# Altium schematic sheet DACֹֹ_Sources.SchDoc (part 1 of 2)
size A0; SheetNumber: 1; SheetTotal: 3; SPICEModelCacheJFWWXDGG: <root> / <DocumentId>JFWWXDGG</DocumentId> / </root>
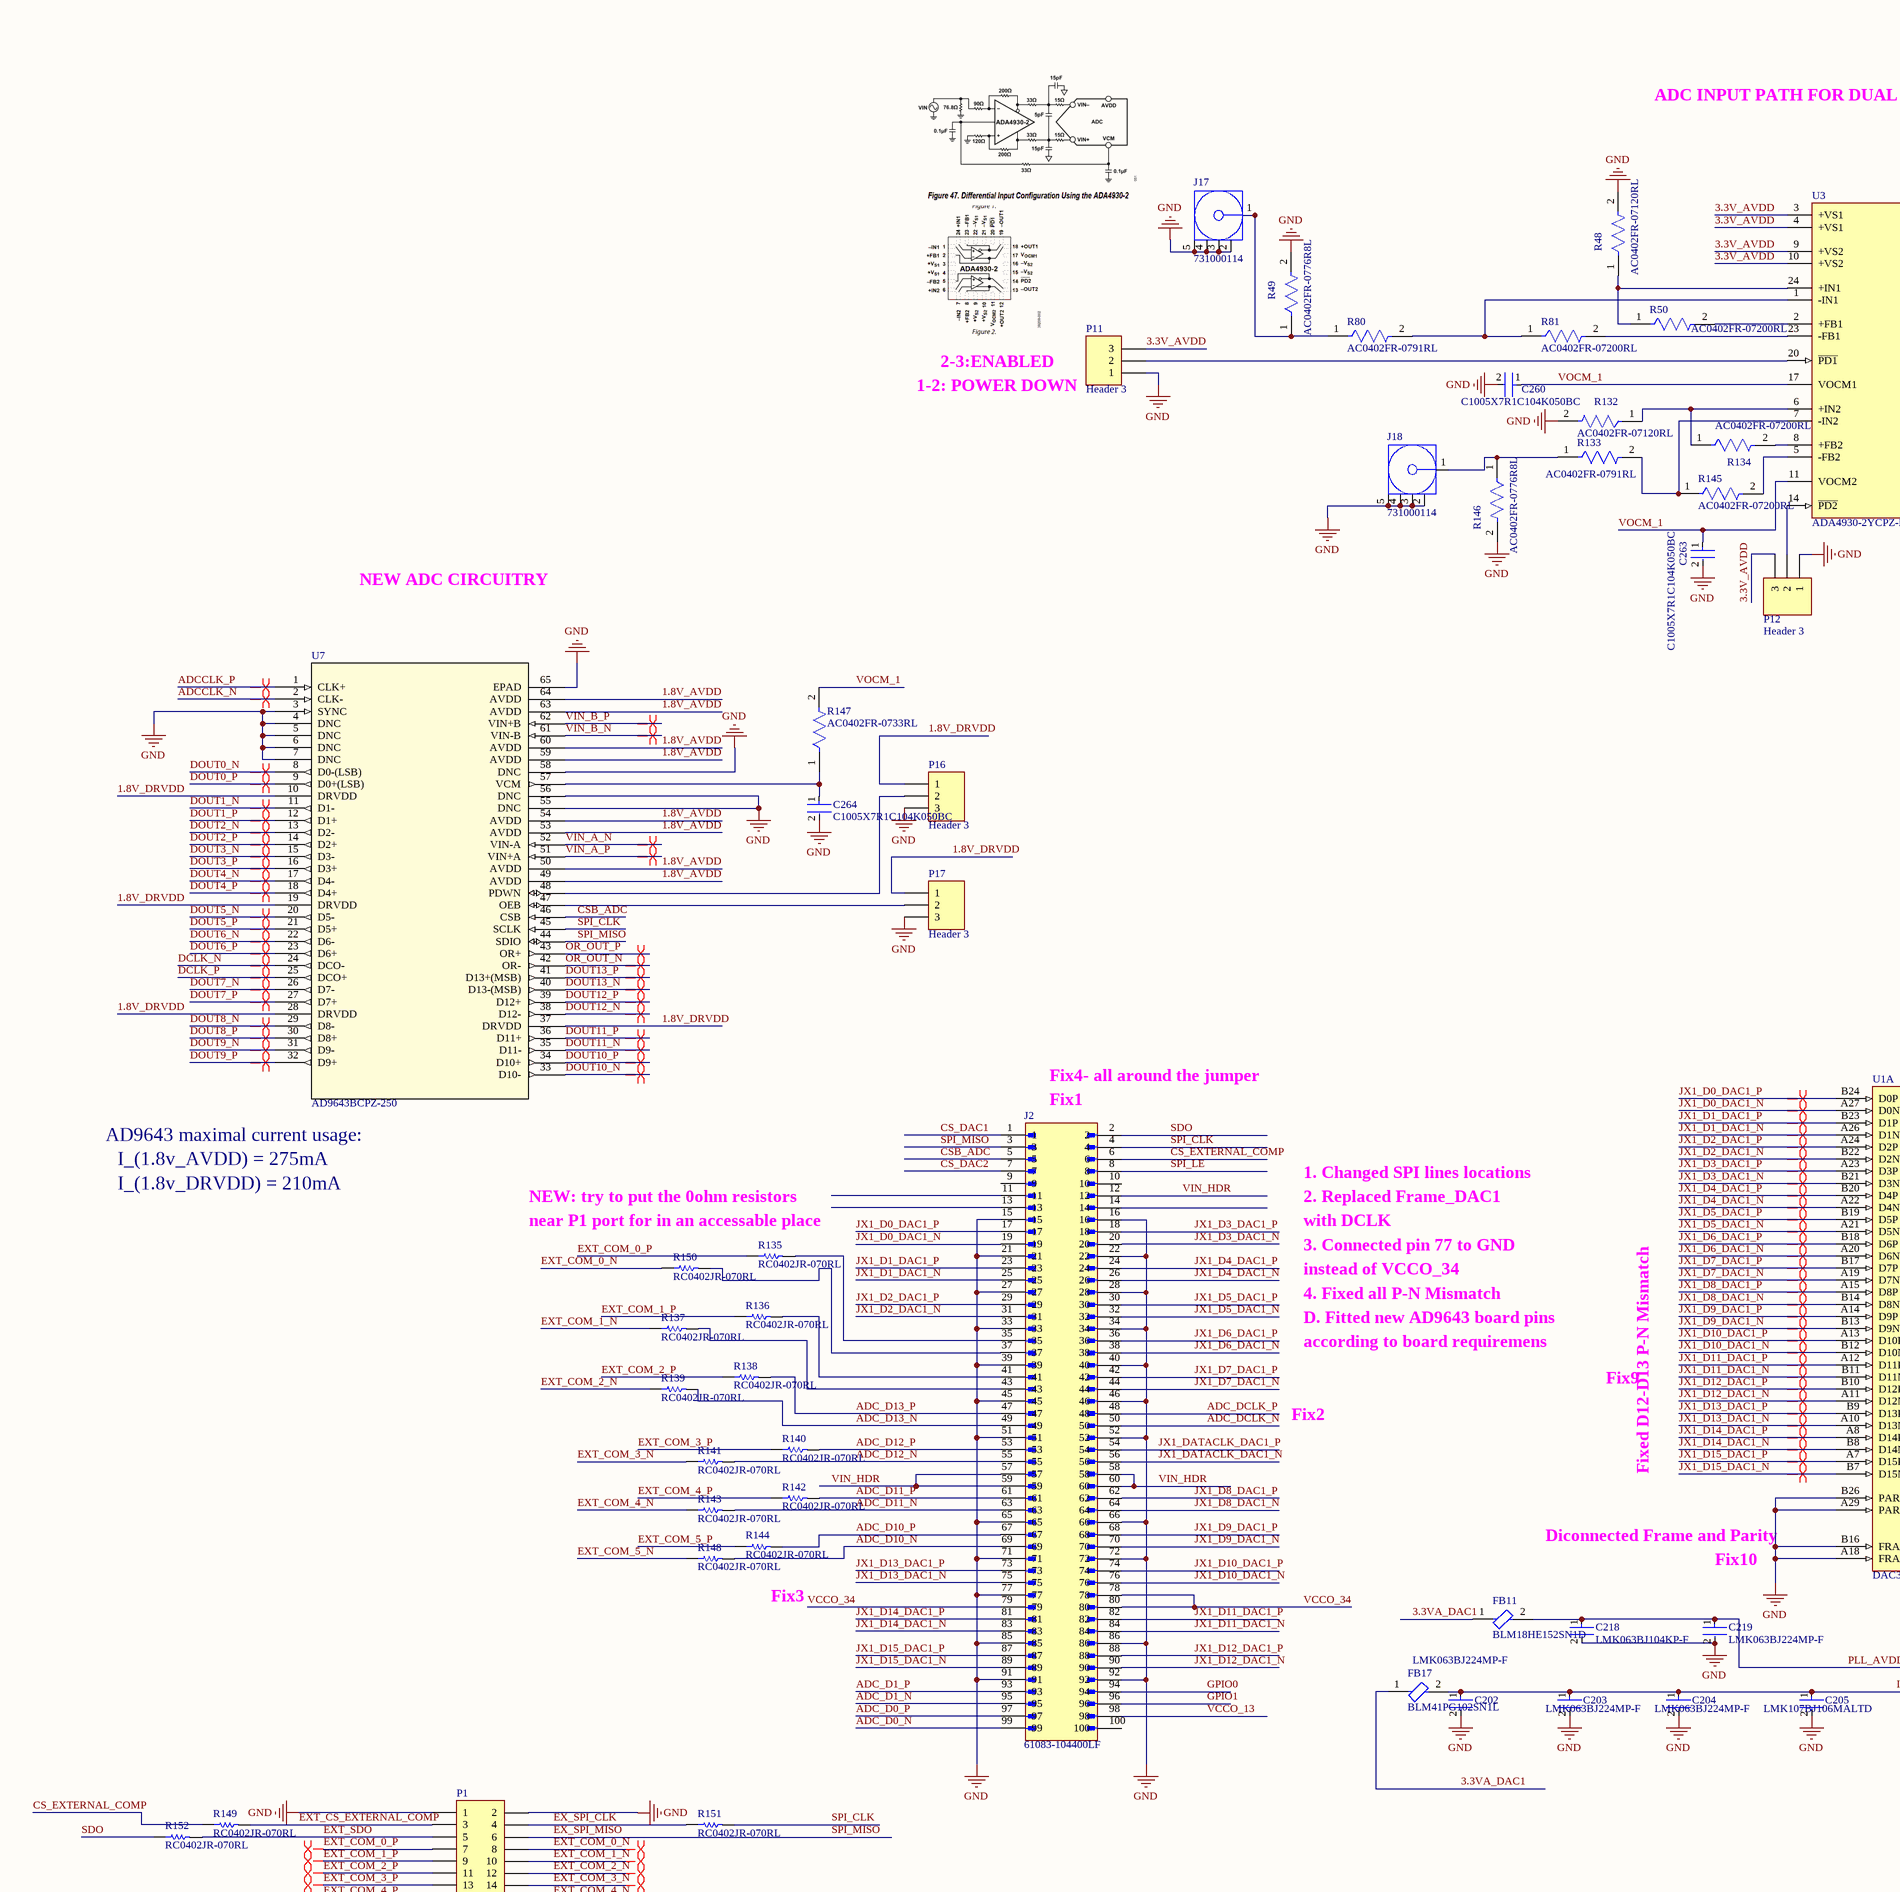
[diagram p0: DACֹֹ_Sources.SchDoc, top left]
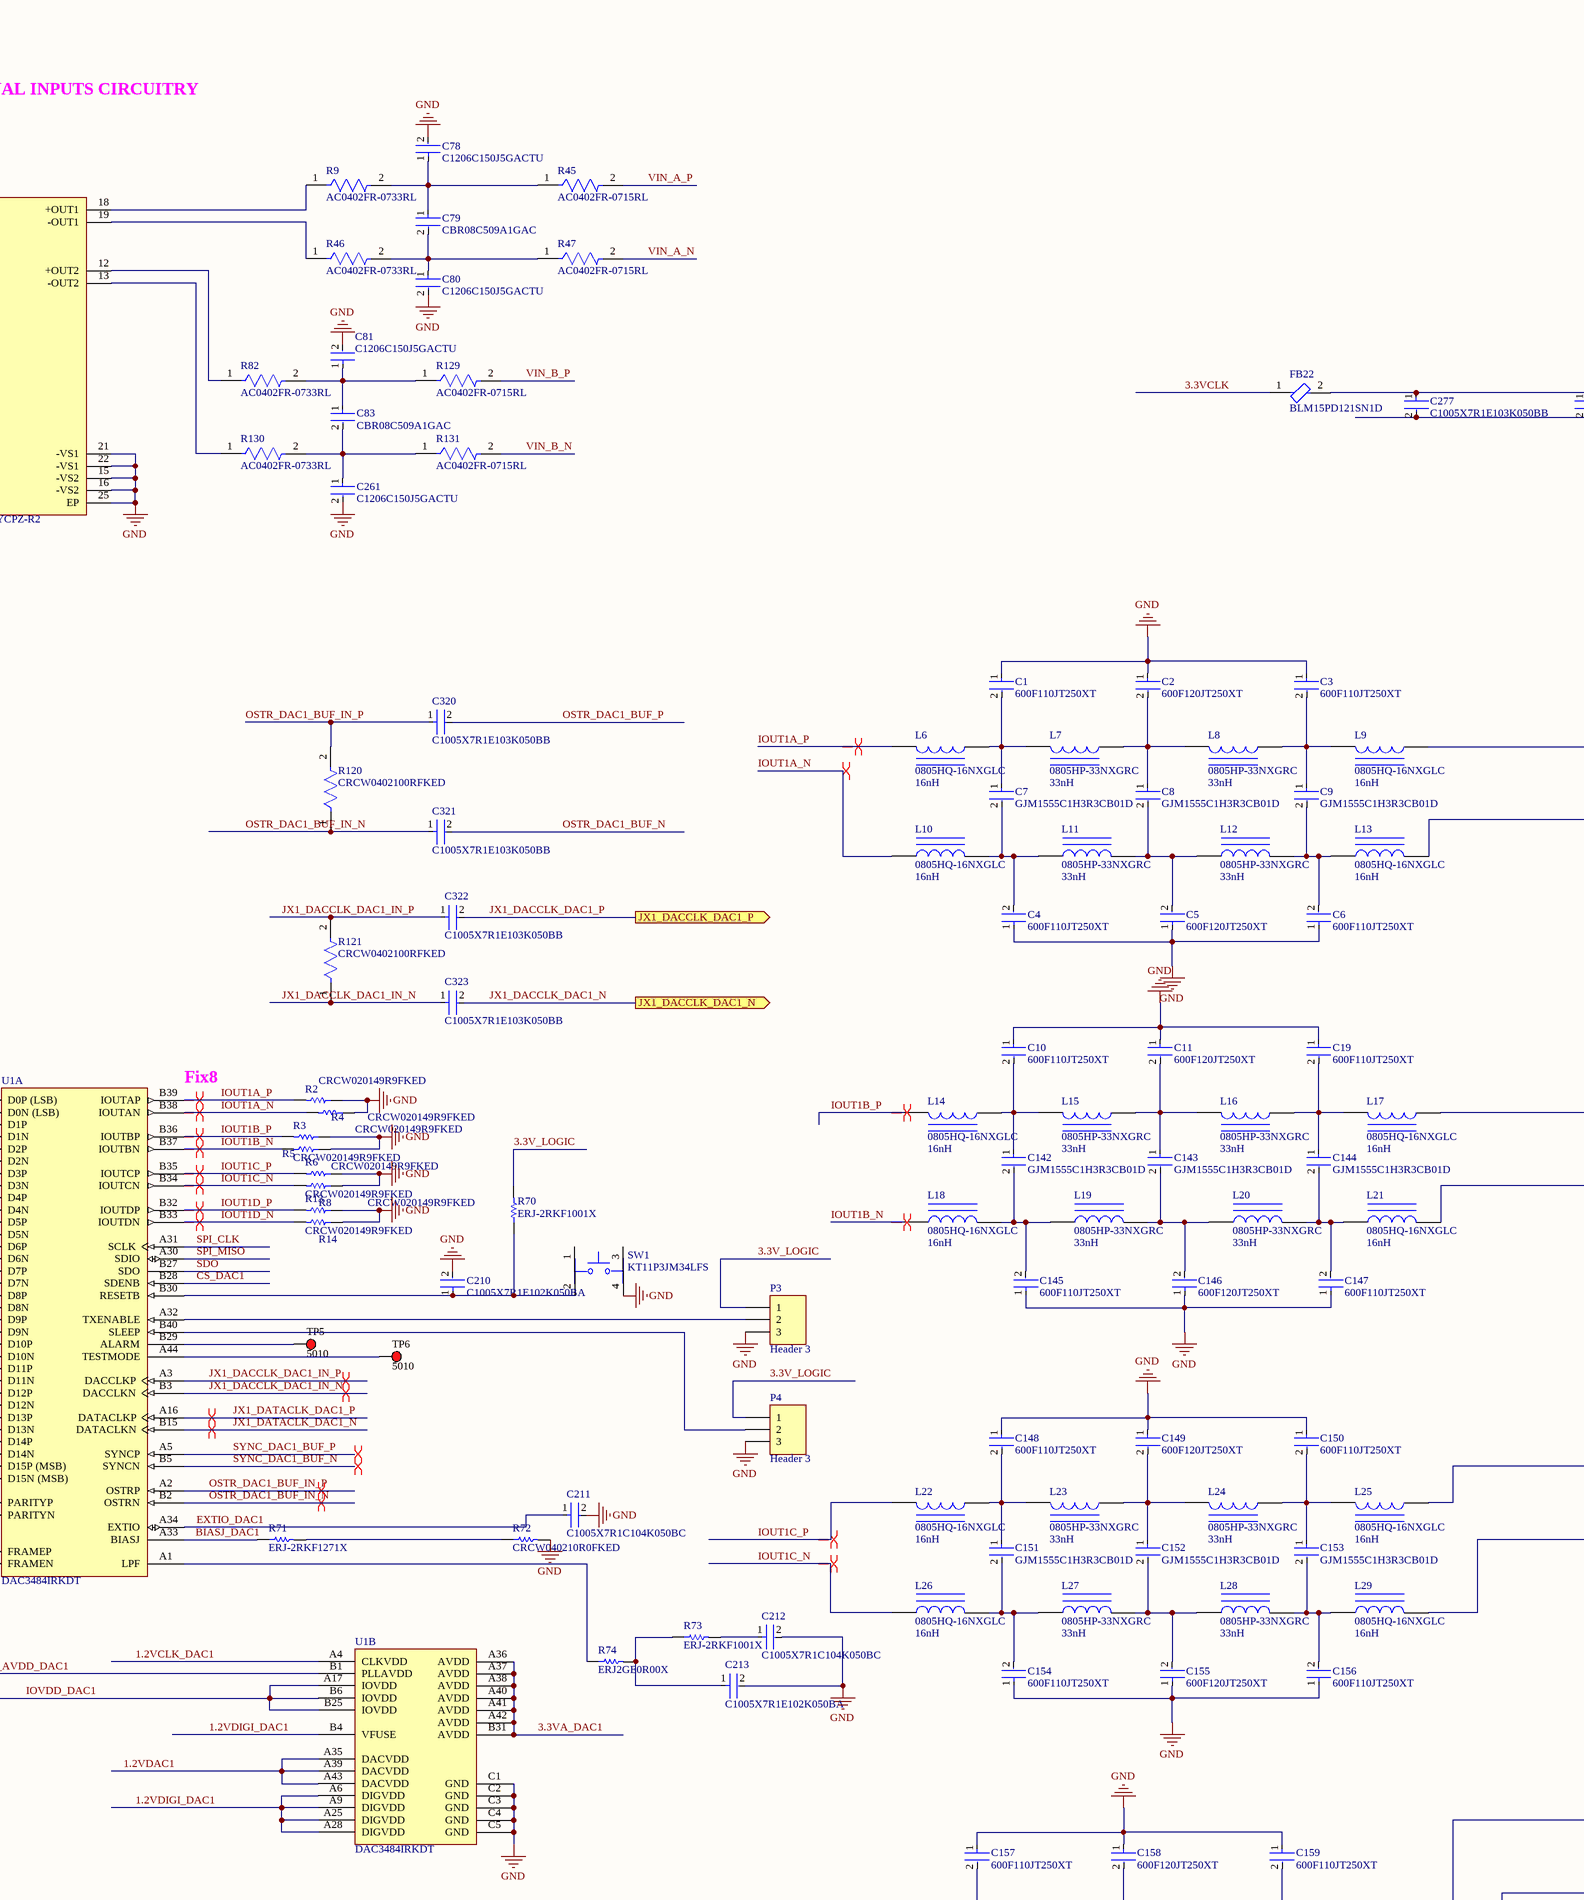
[diagram p1: DACֹֹ_Sources.SchDoc, top middle]
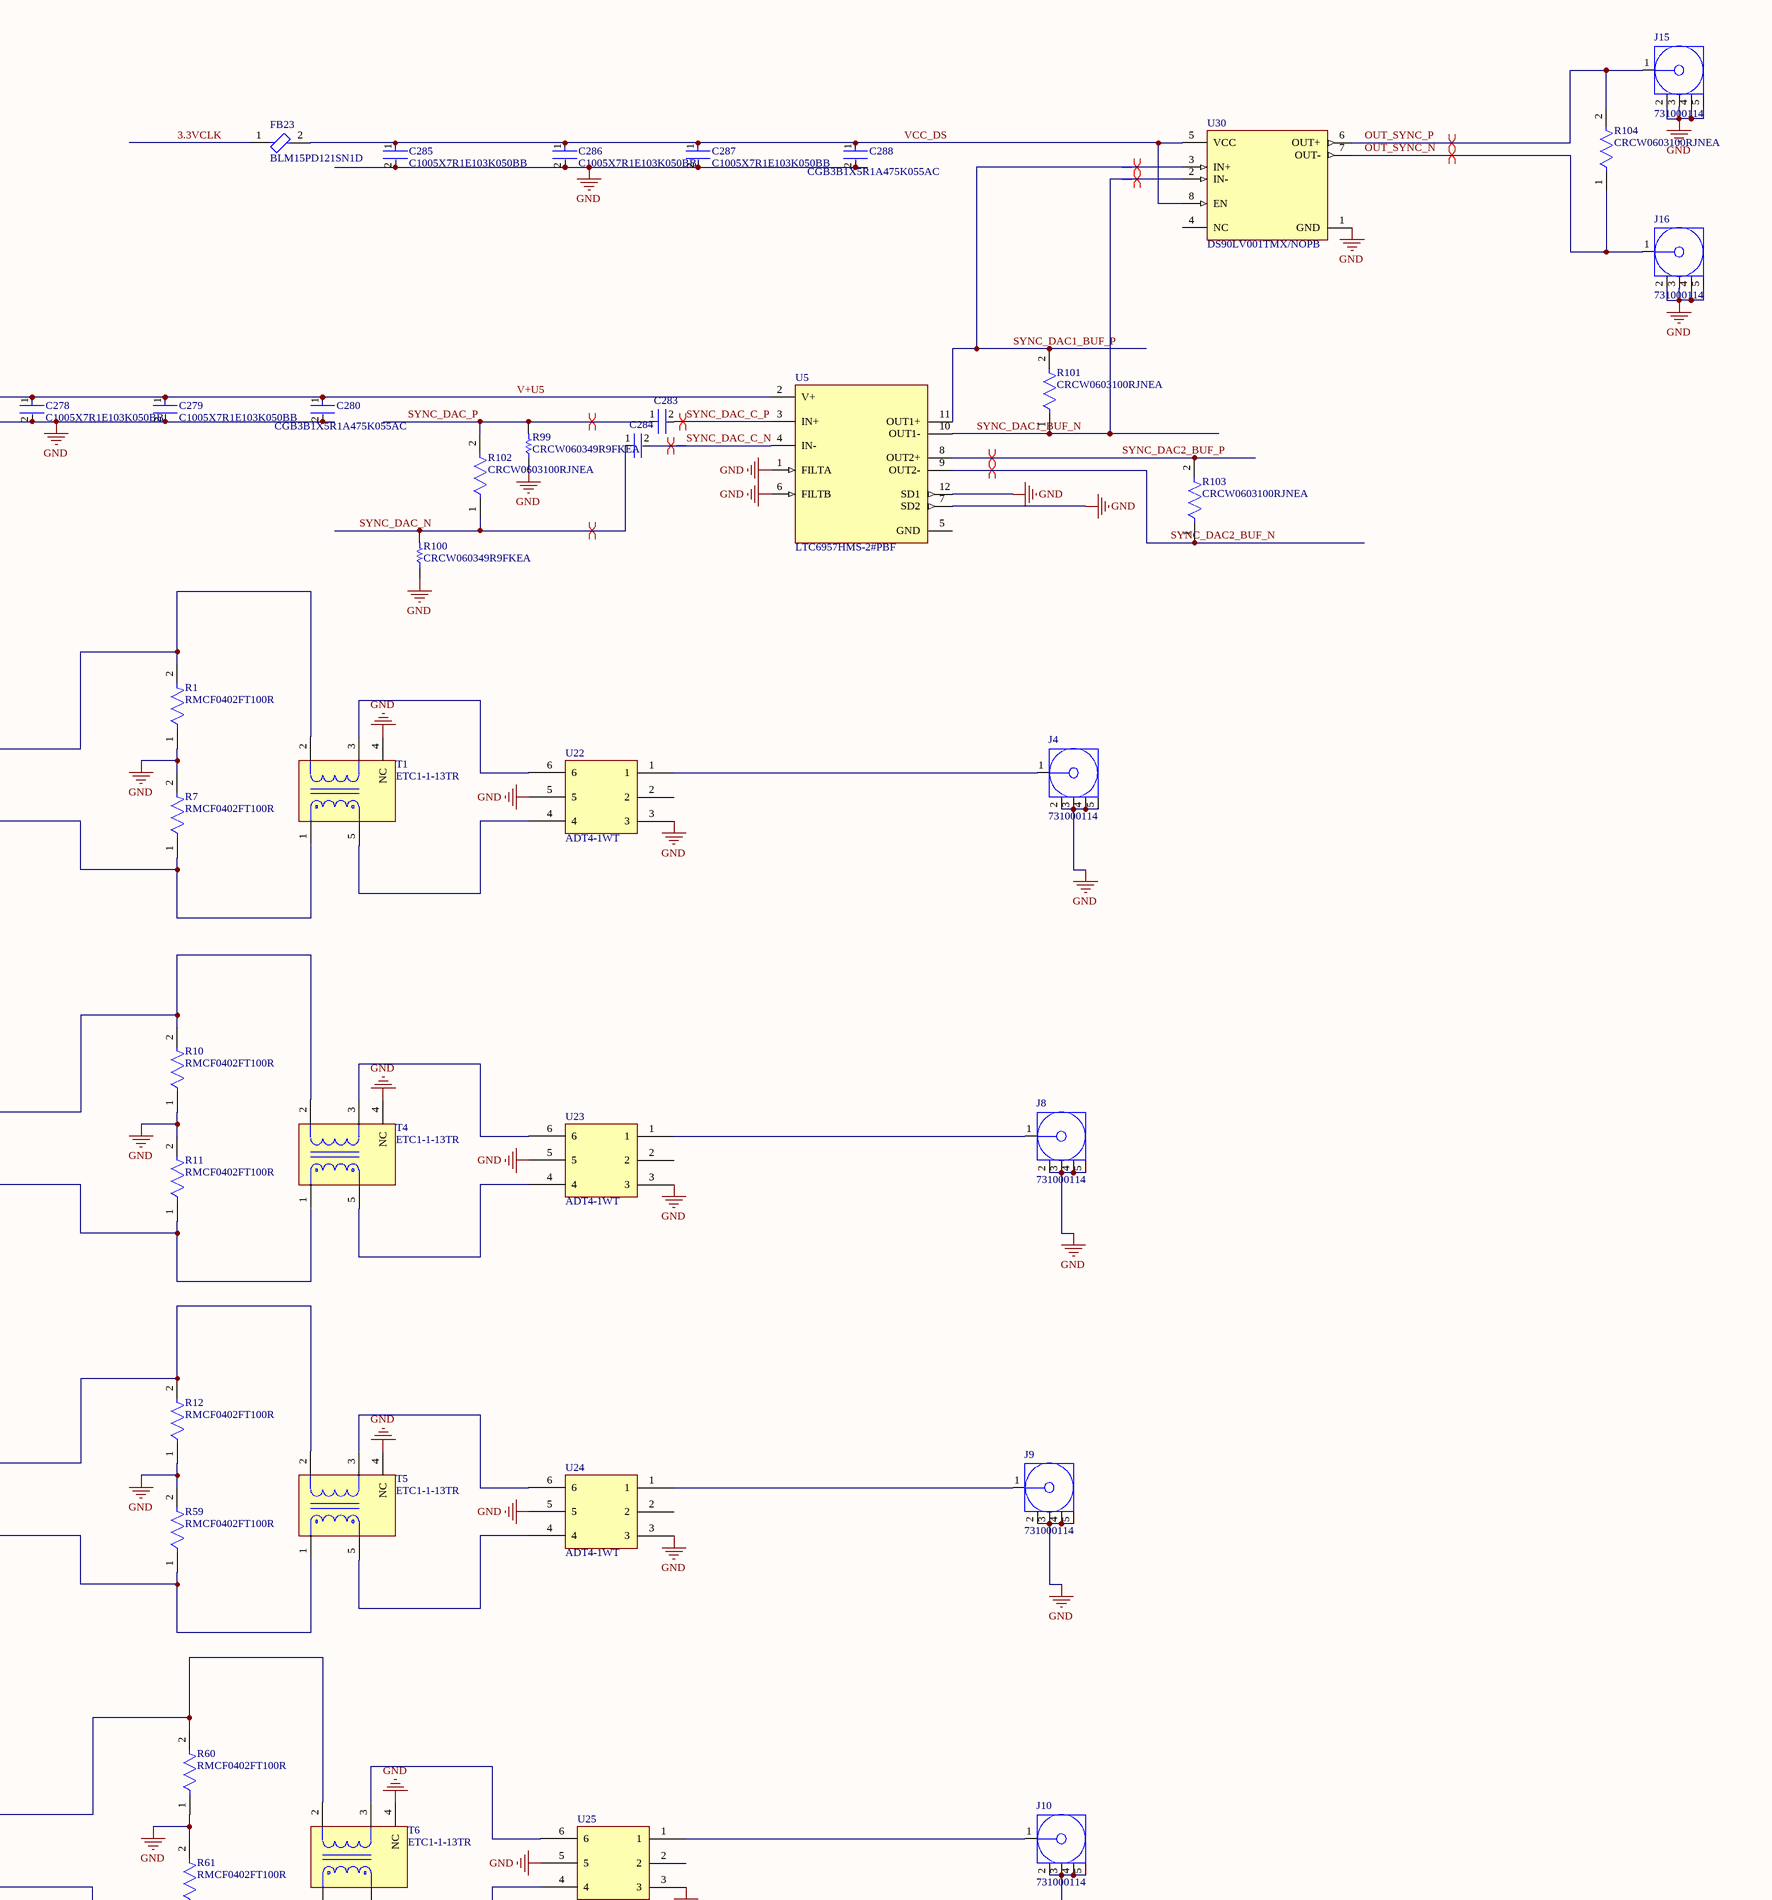
[diagram p2: DACֹֹ_Sources.SchDoc, top right]
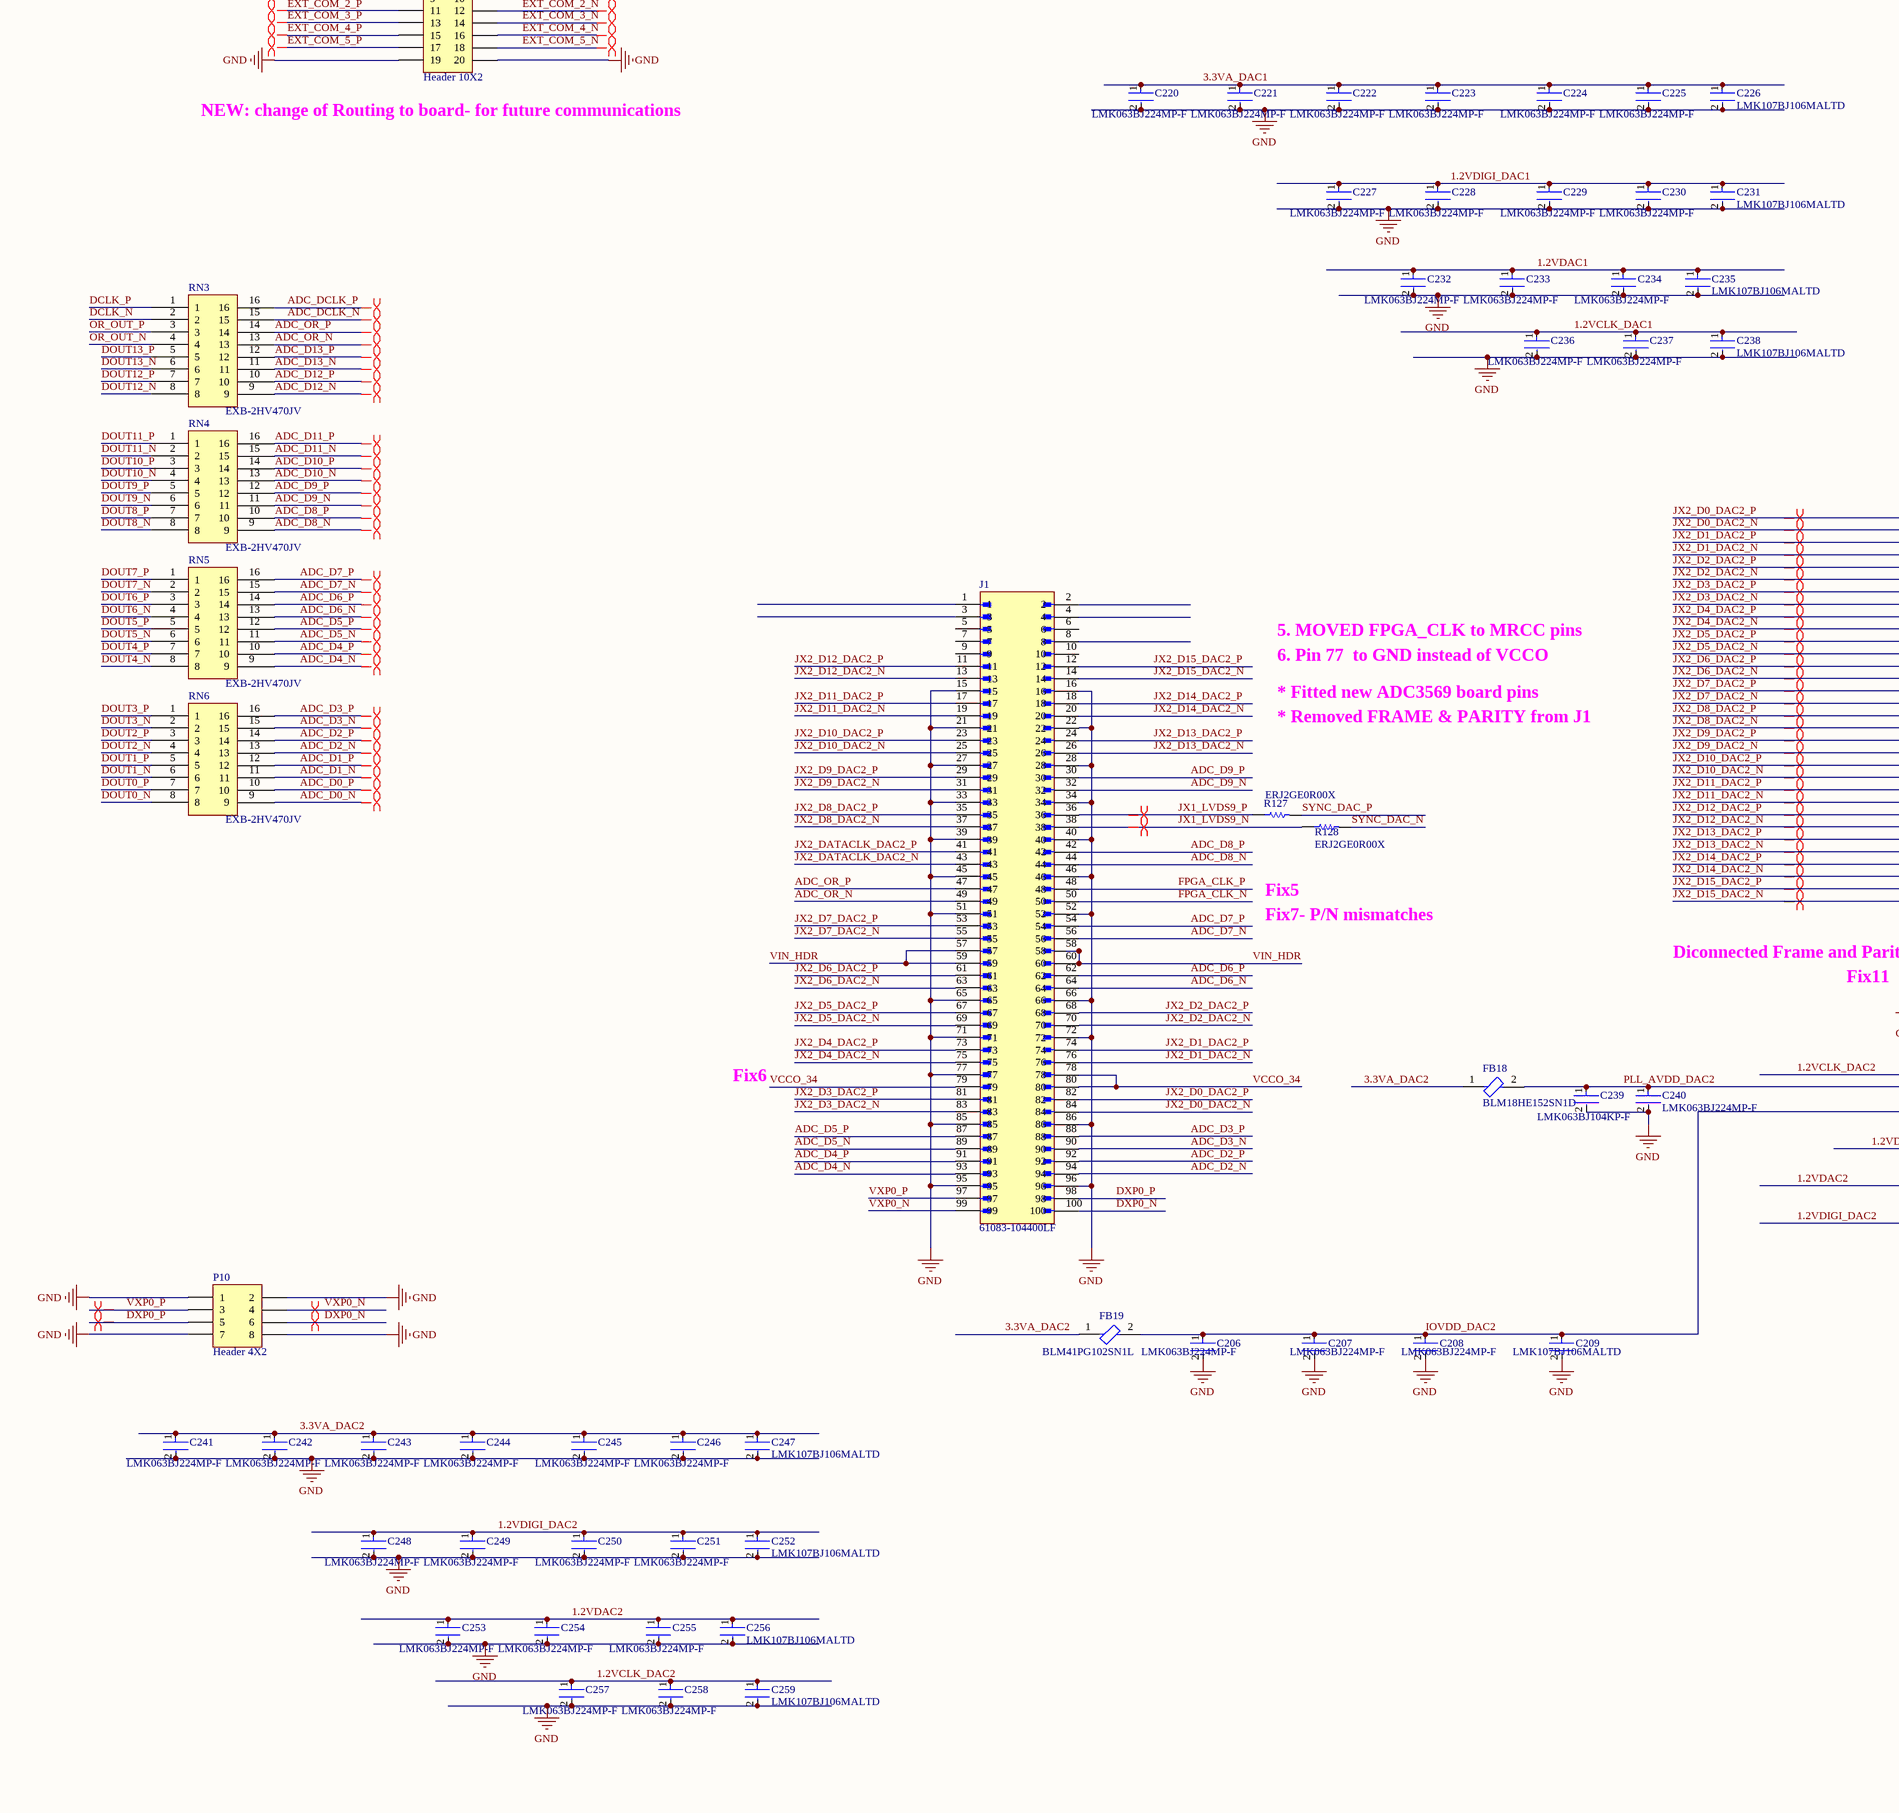
[diagram p3: DACֹֹ_Sources.SchDoc, bottom left]
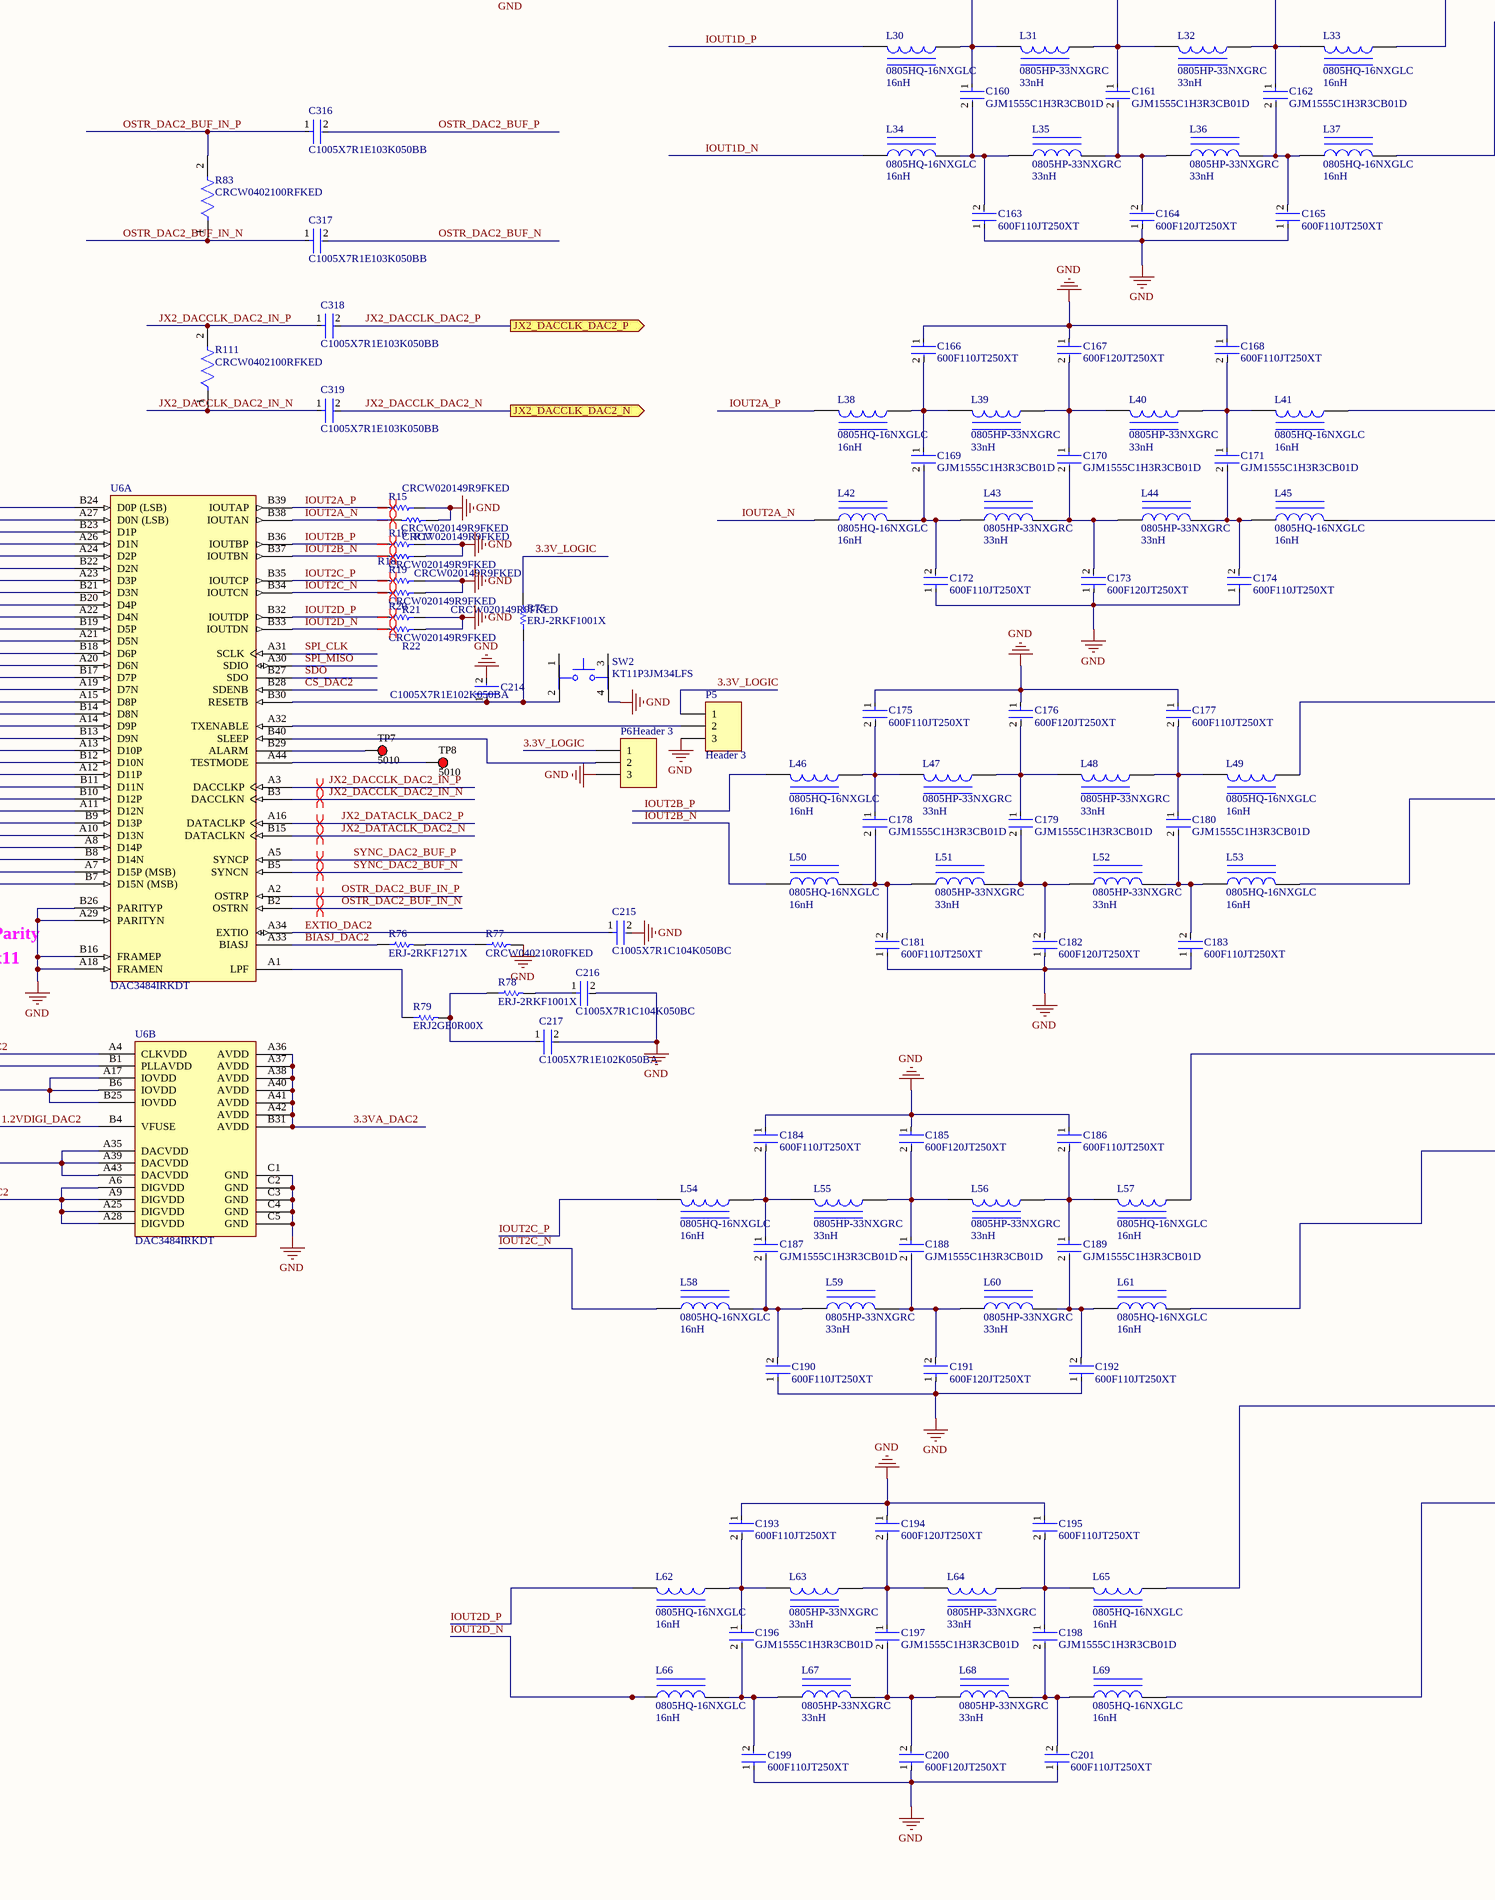
[diagram p4: DACֹֹ_Sources.SchDoc, bottom middle]
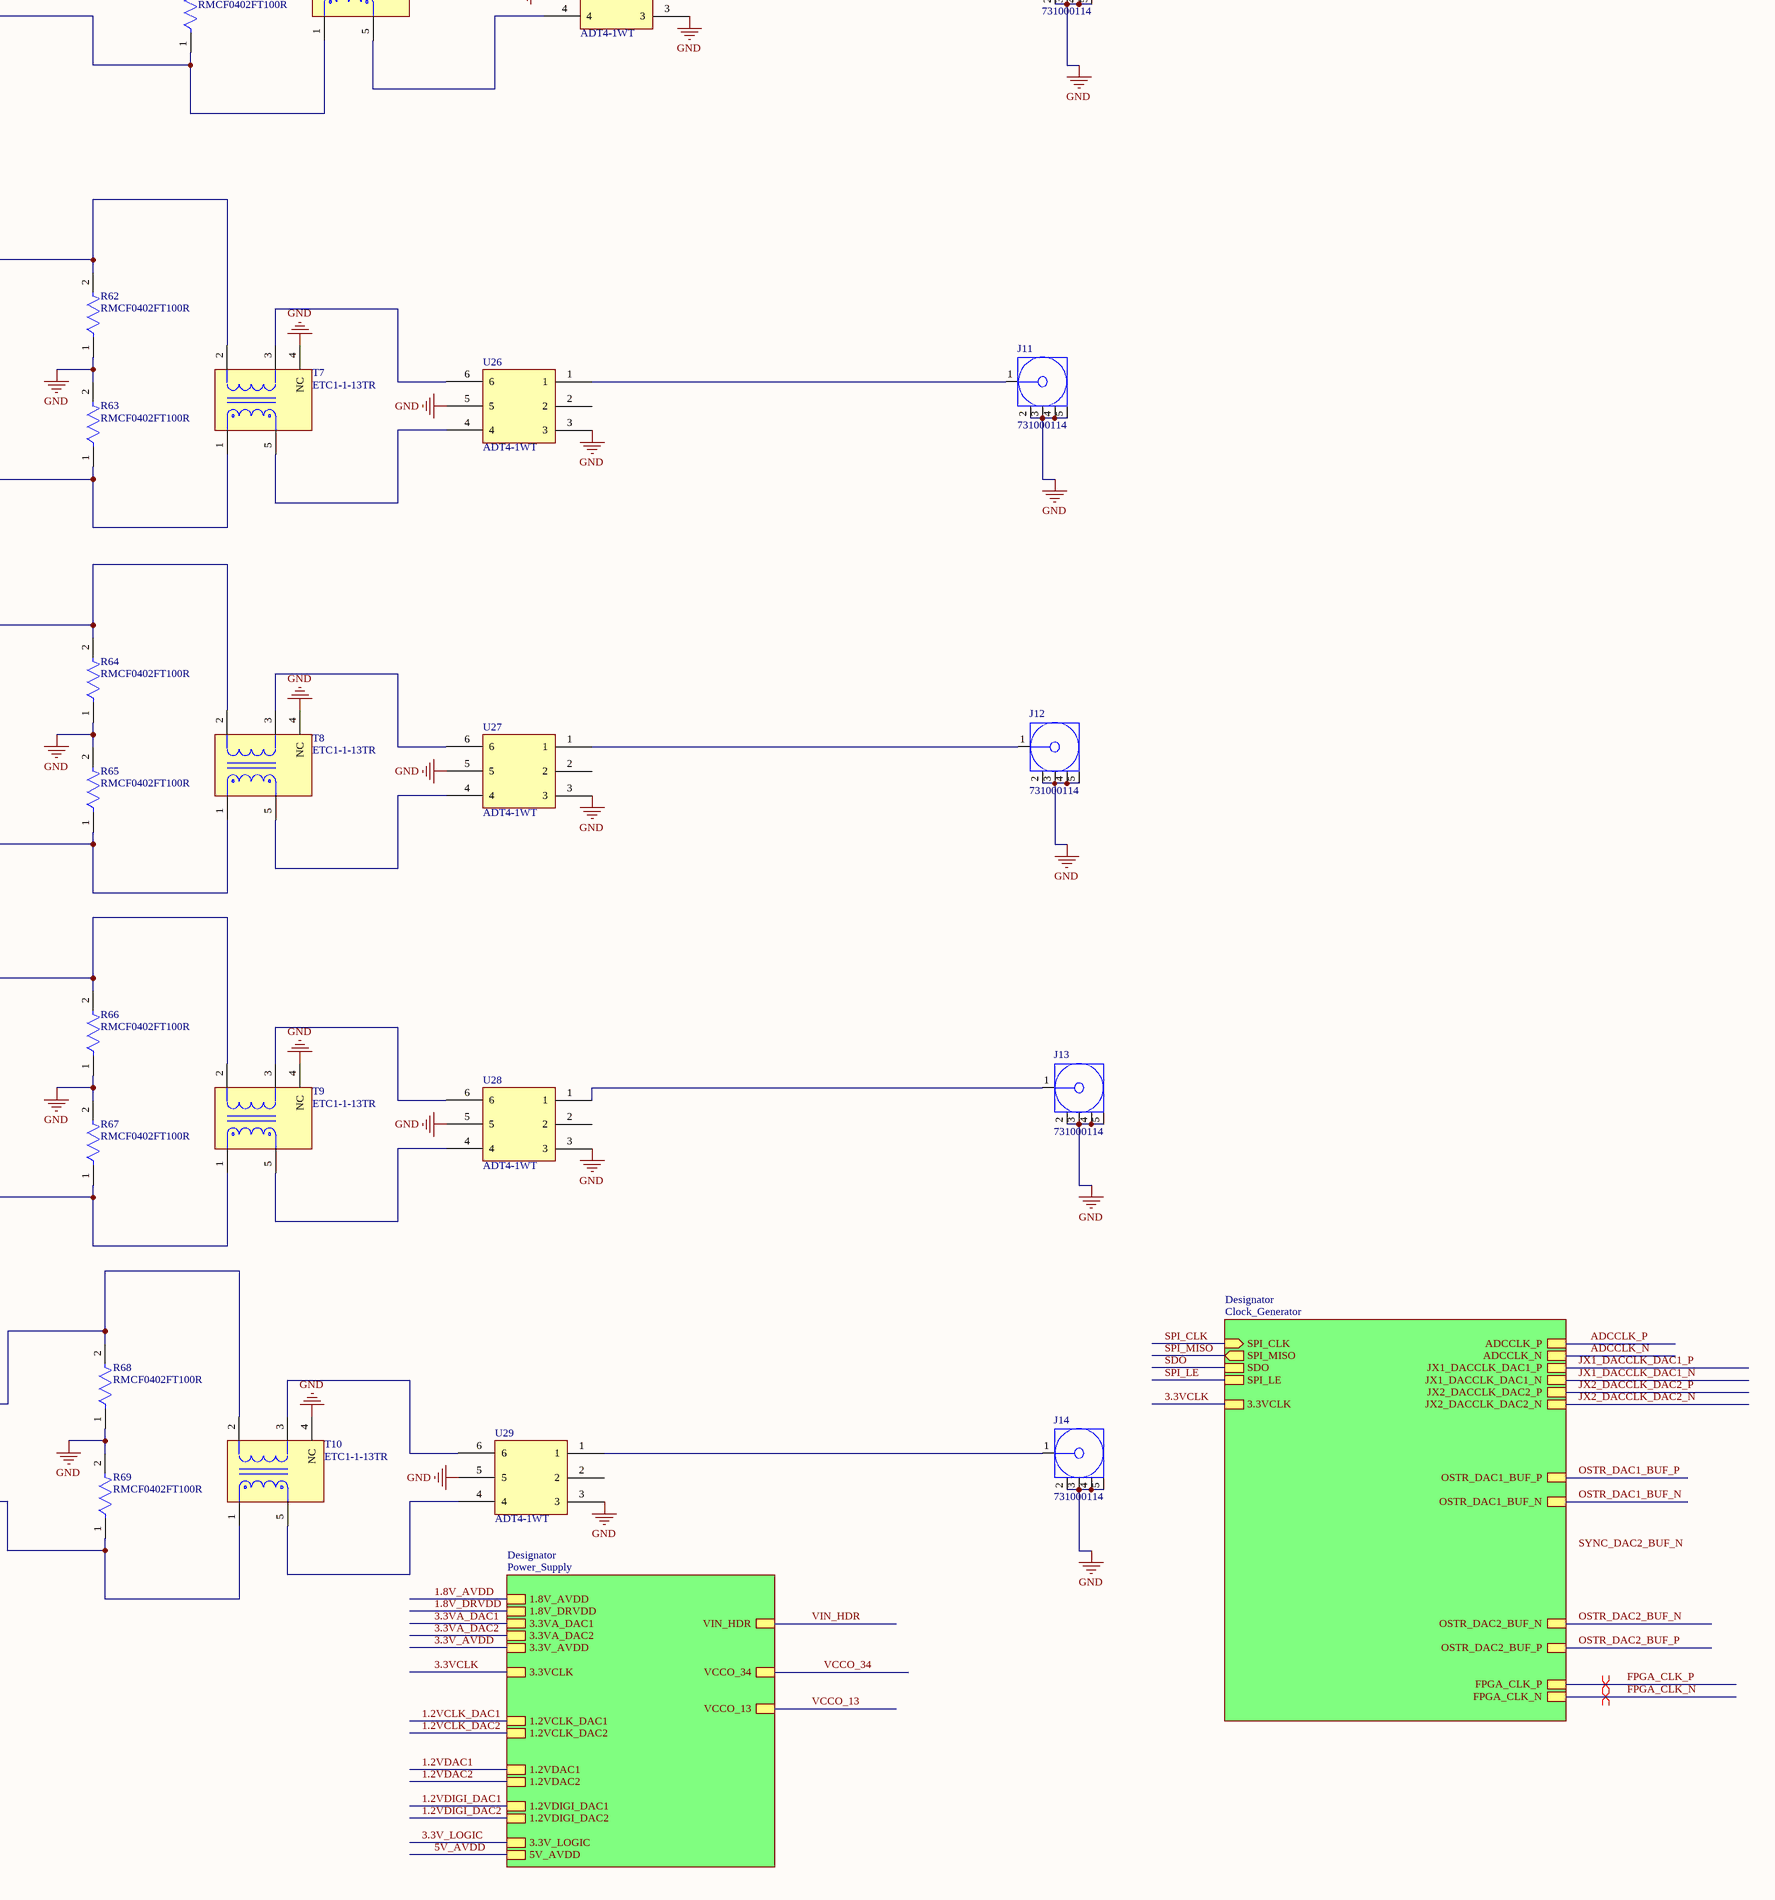
[diagram p5: DACֹֹ_Sources.SchDoc, bottom right]

## Parts
C1  600F110JT250XT  [C0805]
C2  600F120JT250XT  [C0805]
C3  600F110JT250XT  [C0805]
C4  600F110JT250XT  [C0805]
C5  600F120JT250XT  [C0805]
C6  600F110JT250XT  [C0805]
C7  GJM1555C1H3R3CB01D  [C0402]
C8  GJM1555C1H3R3CB01D  [C0402]
C9  GJM1555C1H3R3CB01D  [C0402]
C10  600F110JT250XT  [C0805]
C11  600F120JT250XT  [C0805]
C19  600F110JT250XT  [C0805]
C78  C1206C150J5GACTU  [C1206]
C79  CBR08C509A1GAC  [C0805]
C80  C1206C150J5GACTU  [C1206]
C81  C1206C150J5GACTU  [C1206]
C83  CBR08C509A1GAC  [C0805]
C142  GJM1555C1H3R3CB01D  [C0402]
C143  GJM1555C1H3R3CB01D  [C0402]
C144  GJM1555C1H3R3CB01D  [C0402]
C145  600F110JT250XT  [C0805]
C146  600F120JT250XT  [C0805]
C147  600F110JT250XT  [C0805]
C148  600F110JT250XT  [C0805]
C149  600F120JT250XT  [C0805]
C150  600F110JT250XT  [C0805]
C151  GJM1555C1H3R3CB01D  [C0402]
C152  GJM1555C1H3R3CB01D  [C0402]
C153  GJM1555C1H3R3CB01D  [C0402]
C154  600F110JT250XT  [C0805]
C155  600F120JT250XT  [C0805]
C156  600F110JT250XT  [C0805]
C157  600F110JT250XT  [C0805]
C158  600F120JT250XT  [C0805]
C159  600F110JT250XT  [C0805]
C160  GJM1555C1H3R3CB01D  [C0402]
C161  GJM1555C1H3R3CB01D  [C0402]
C162  GJM1555C1H3R3CB01D  [C0402]
C163  600F110JT250XT  [C0805]
C164  600F120JT250XT  [C0805]
C165  600F110JT250XT  [C0805]
C166  600F110JT250XT  [C0805]
C167  600F120JT250XT  [C0805]
C168  600F110JT250XT  [C0805]
C169  GJM1555C1H3R3CB01D  [C0402]
C170  GJM1555C1H3R3CB01D  [C0402]
C171  GJM1555C1H3R3CB01D  [C0402]
C172  600F110JT250XT  [C0805]
C173  600F120JT250XT  [C0805]
C174  600F110JT250XT  [C0805]
C175  600F110JT250XT  [C0805]
C176  600F120JT250XT  [C0805]
C177  600F110JT250XT  [C0805]
C178  GJM1555C1H3R3CB01D  [C0402]
C179  GJM1555C1H3R3CB01D  [C0402]
C180  GJM1555C1H3R3CB01D  [C0402]
C181  600F110JT250XT  [C0805]
C182  600F120JT250XT  [C0805]
C183  600F110JT250XT  [C0805]
C184  600F110JT250XT  [C0805]
C185  600F120JT250XT  [C0805]
C186  600F110JT250XT  [C0805]
C187  GJM1555C1H3R3CB01D  [C0402]
C188  GJM1555C1H3R3CB01D  [C0402]
C189  GJM1555C1H3R3CB01D  [C0402]
C190  600F110JT250XT  [C0805]
C191  600F120JT250XT  [C0805]
C192  600F110JT250XT  [C0805]
C193  600F110JT250XT  [C0805]
C194  600F120JT250XT  [C0805]
C195  600F110JT250XT  [C0805]
C196  GJM1555C1H3R3CB01D  [C0402]
C197  GJM1555C1H3R3CB01D  [C0402]
C198  GJM1555C1H3R3CB01D  [C0402]
C199  600F110JT250XT  [C0805]
C200  600F120JT250XT  [C0805]
C201  600F110JT250XT  [C0805]
C202  LMK063BJ224MP-F  [C0201]
C203  LMK063BJ224MP-F  [C0201]
C204  LMK063BJ224MP-F  [C0201]
C205  LMK107BJ106MALTD  [C0603]
C206  LMK063BJ224MP-F  [C0201]
C207  LMK063BJ224MP-F  [C0201]
C208  LMK063BJ224MP-F  [C0201]
C209  LMK107BJ106MALTD  [C0603]
C210  C1005X7R1E102K050BA  [C0402]
C211  C1005X7R1C104K050BC  [C0402]
C212  C1005X7R1C104K050BC  [C0402]
C213  C1005X7R1E102K050BA  [C0402]
C214  C1005X7R1E102K050BA  [C0402]
C215  C1005X7R1C104K050BC  [C0402]
C216  C1005X7R1C104K050BC  [C0402]
C217  C1005X7R1E102K050BA  [C0402]
C218  LMK063BJ104KP-F  [C0201]
C219  LMK063BJ224MP-F  [C0201]
C220  LMK063BJ224MP-F  [C0201]
C221  LMK063BJ224MP-F  [C0201]
C222  LMK063BJ224MP-F  [C0201]
C223  LMK063BJ224MP-F  [C0201]
C224  LMK063BJ224MP-F  [C0201]
C225  LMK063BJ224MP-F  [C0201]
C226  LMK107BJ106MALTD  [C0603]
C227  LMK063BJ224MP-F  [C0201]
C228  LMK063BJ224MP-F  [C0201]
C229  LMK063BJ224MP-F  [C0201]
C230  LMK063BJ224MP-F  [C0201]
C231  LMK107BJ106MALTD  [C0603]
C232  LMK063BJ224MP-F  [C0201]
C233  LMK063BJ224MP-F  [C0201]
C234  LMK063BJ224MP-F  [C0201]
C235  LMK107BJ106MALTD  [C0603]
C236  LMK063BJ224MP-F  [C0201]
C237  LMK063BJ224MP-F  [C0201]
C238  LMK107BJ106MALTD  [C0603]
C239  LMK063BJ104KP-F  [C0201]
C240  LMK063BJ224MP-F  [C0201]
C241  LMK063BJ224MP-F  [C0201]
C242  LMK063BJ224MP-F  [C0201]
C243  LMK063BJ224MP-F  [C0201]
C244  LMK063BJ224MP-F  [C0201]
C245  LMK063BJ224MP-F  [C0201]
C246  LMK063BJ224MP-F  [C0201]
C247  LMK107BJ106MALTD  [C0603]
C248  LMK063BJ224MP-F  [C0201]
C249  LMK063BJ224MP-F  [C0201]
C250  LMK063BJ224MP-F  [C0201]
C251  LMK063BJ224MP-F  [C0201]
C252  LMK107BJ106MALTD  [C0603]
C253  LMK063BJ224MP-F  [C0201]
C254  LMK063BJ224MP-F  [C0201]
C255  LMK063BJ224MP-F  [C0201]
C256  LMK107BJ106MALTD  [C0603]
C257  LMK063BJ224MP-F  [C0201]
C258  LMK063BJ224MP-F  [C0201]
C259  LMK107BJ106MALTD  [C0603]
C260  C1005X7R1C104K050BC  [C0402]
C261  C1206C150J5GACTU  [C1206]
C263  C1005X7R1C104K050BC  [C0402]
C264  C1005X7R1C104K050BC  [C0402]
C277  C1005X7R1E103K050BB  [C0402]
C278  C1005X7R1E103K050BB  [C0402]
C279  C1005X7R1E103K050BB  [C0402]
C280  CGB3B1X5R1A475K055AC  [C0603]
C283  CC0603KRX7R9BB103  [C0603]  (value not drawn)
C284  CC0603KRX7R9BB103  [C0603]  (value not drawn)
C285  C1005X7R1E103K050BB  [C0402]
C286  C1005X7R1E103K050BB  [C0402]
C287  C1005X7R1E103K050BB  [C0402]
C288  CGB3B1X5R1A475K055AC  [C0603]
C316  C1005X7R1E103K050BB  [C0402]
C317  C1005X7R1E103K050BB  [C0402]
C318  C1005X7R1E103K050BB  [C0402]
C319  C1005X7R1E103K050BB  [C0402]
C320  C1005X7R1E103K050BB  [C0402]
C321  C1005X7R1E103K050BB  [C0402]
C322  C1005X7R1E103K050BB  [C0402]
C323  C1005X7R1E103K050BB  [C0402]
FB11  BLM18HE152SN1D  [BLM18]
FB17  BLM41PG102SN1L  [BLM41]
FB18  BLM18HE152SN1D  [BLM41]
FB19  BLM41PG102SN1L  [BLM41]
FB22  BLM15PD121SN1D  [BLM15]
FB23  BLM15PD121SN1D  [BLM15]
J1  61083-104400LF  [AMPHENOL_61083-104400LF]
J2  61083-104400LF  [AMPHENOL_61083-104400LF]
J4  731000114  [MOLX-731000114_V]
J8  731000114  [MOLX-731000114_V]
J9  731000114  [MOLX-731000114_V]
J10  731000114  [MOLX-731000114_V]
J11  731000114  [MOLX-731000114_V]
J12  731000114  [MOLX-731000114_V]
J13  731000114  [MOLX-731000114_V]
J14  731000114  [MOLX-731000114_V]
J15  731000114  [MOLX-731000114_V]
J16  731000114  [MOLX-731000114_V]
J17  731000114  [MOLX-731000114_V]
J18  731000114  [MOLX-731000114_V]
L6  0805HQ-16NXGLC  value 16nH  [0805HP]
L7  0805HP-33NXGRC  value 33nH  [0805HP]
L8  0805HP-33NXGRC  value 33nH  [0805HP]
L9  0805HQ-16NXGLC  value 16nH  [0805HP]
L10  0805HQ-16NXGLC  value 16nH  [0805HP]
L11  0805HP-33NXGRC  value 33nH  [0805HP]
L12  0805HP-33NXGRC  value 33nH  [0805HP]
L13  0805HQ-16NXGLC  value 16nH  [0805HP]
L14  0805HQ-16NXGLC  value 16nH  [0805HP]
L15  0805HP-33NXGRC  value 33nH  [0805HP]
L16  0805HP-33NXGRC  value 33nH  [0805HP]
L17  0805HQ-16NXGLC  value 16nH  [0805HP]
L18  0805HQ-16NXGLC  value 16nH  [0805HP]
L19  0805HP-33NXGRC  value 33nH  [0805HP]
L20  0805HP-33NXGRC  value 33nH  [0805HP]
L21  0805HQ-16NXGLC  value 16nH  [0805HP]
L22  0805HQ-16NXGLC  value 16nH  [0805HP]
L23  0805HP-33NXGRC  value 33nH  [0805HP]
L24  0805HP-33NXGRC  value 33nH  [0805HP]
L25  0805HQ-16NXGLC  value 16nH  [0805HP]
L26  0805HQ-16NXGLC  value 16nH  [0805HP]
L27  0805HP-33NXGRC  value 33nH  [0805HP]
L28  0805HP-33NXGRC  value 33nH  [0805HP]
L29  0805HQ-16NXGLC  value 16nH  [0805HP]
L30  0805HQ-16NXGLC  value 16nH  [0805HP]
L31  0805HP-33NXGRC  value 33nH  [0805HP]
L32  0805HP-33NXGRC  value 33nH  [0805HP]
L33  0805HQ-16NXGLC  value 16nH  [0805HP]
L34  0805HQ-16NXGLC  value 16nH  [0805HP]
L35  0805HP-33NXGRC  value 33nH  [0805HP]
L36  0805HP-33NXGRC  value 33nH  [0805HP]
L37  0805HQ-16NXGLC  value 16nH  [0805HP]
L38  0805HQ-16NXGLC  value 16nH  [0805HP]
L39  0805HP-33NXGRC  value 33nH  [0805HP]
L40  0805HP-33NXGRC  value 33nH  [0805HP]
L41  0805HQ-16NXGLC  value 16nH  [0805HP]
L42  0805HQ-16NXGLC  value 16nH  [0805HP]
L43  0805HP-33NXGRC  value 33nH  [0805HP]
L44  0805HP-33NXGRC  value 33nH  [0805HP]
L45  0805HQ-16NXGLC  value 16nH  [0805HP]
L46  0805HQ-16NXGLC  value 16nH  [0805HP]
L47  0805HP-33NXGRC  value 33nH  [0805HP]
L48  0805HP-33NXGRC  value 33nH  [0805HP]
L49  0805HQ-16NXGLC  value 16nH  [0805HP]
L50  0805HQ-16NXGLC  value 16nH  [0805HP]
L51  0805HP-33NXGRC  value 33nH  [0805HP]
L52  0805HP-33NXGRC  value 33nH  [0805HP]
L53  0805HQ-16NXGLC  value 16nH  [0805HP]
L54  0805HQ-16NXGLC  value 16nH  [0805HP]
L55  0805HP-33NXGRC  value 33nH  [0805HP]
L56  0805HP-33NXGRC  value 33nH  [0805HP]
L57  0805HQ-16NXGLC  value 16nH  [0805HP]
L58  0805HQ-16NXGLC  value 16nH  [0805HP]
L59  0805HP-33NXGRC  value 33nH  [0805HP]
L60  0805HP-33NXGRC  value 33nH  [0805HP]
L61  0805HQ-16NXGLC  value 16nH  [0805HP]
L62  0805HQ-16NXGLC  value 16nH  [0805HP]
L63  0805HP-33NXGRC  value 33nH  [0805HP]
L64  0805HP-33NXGRC  value 33nH  [0805HP]
L65  0805HQ-16NXGLC  value 16nH  [0805HP]
L66  0805HQ-16NXGLC  value 16nH  [0805HP]
L67  0805HP-33NXGRC  value 33nH  [0805HP]
L68  0805HP-33NXGRC  value 33nH  [0805HP]
L69  0805HQ-16NXGLC  value 16nH  [0805HP]
P1  Header 10X2  [HEADER_10X2]
P3  Header 3  [HEADER_3X1]
P4  Header 3  [HEADER_3X1]
P5  Header 3  [HEADER_3X1]
P6  Header 3  [HEADER_3X1]
P10  Header 4X2  [HEADER_4X2]
P11  Header 3  [HEADER_3X1]
P12  Header 3  [HEADER_3X1]
P16  Header 3  [HEADER_3X1]
P17  Header 3  [HEADER_3X1]
R1  RMCF0402FT100R  [R0402]
R2  CRCW020149R9FKED  [R0201]
R3  CRCW020149R9FKED  [R0201]
R4  CRCW020149R9FKED  [R0201]
R5  CRCW020149R9FKED  [R0201]
R6  CRCW020149R9FKED  [R0201]
R7  RMCF0402FT100R  [R0402]
R8  CRCW020149R9FKED  [R0201]
R9  AC0402FR-0733RL  [R0402]
R10  RMCF0402FT100R  [R0402]
R11  RMCF0402FT100R  [R0402]
R12  RMCF0402FT100R  [R0402]
R13  CRCW020149R9FKED  [R0201]
R14  CRCW020149R9FKED  [R0201]
R15  CRCW020149R9FKED  [R0201]
R16  CRCW020149R9FKED  [R0201]
R17  CRCW020149R9FKED  [R0201]
R18  CRCW020149R9FKED  [R0201]
R19  CRCW020149R9FKED  [R0201]
R20  CRCW020149R9FKED  [R0201]
R21  CRCW020149R9FKED  [R0201]
R22  CRCW020149R9FKED  [R0201]
R45  AC0402FR-0715RL  [R0402]
R46  AC0402FR-0733RL  [R0402]
R47  AC0402FR-0715RL  [R0402]
R48  AC0402FR-07120RL  [R0402]
R49  AC0402FR-0776R8L  [R0402]
R50  AC0402FR-07200RL  [R0402]
R59  RMCF0402FT100R  [R0402]
R60  RMCF0402FT100R  [R0402]
R61  RMCF0402FT100R  [R0402]
R62  RMCF0402FT100R  [R0402]
R63  RMCF0402FT100R  [R0402]
R64  RMCF0402FT100R  [R0402]
R65  RMCF0402FT100R  [R0402]
R66  RMCF0402FT100R  [R0402]
R67  RMCF0402FT100R  [R0402]
R68  RMCF0402FT100R  [R0402]
R69  RMCF0402FT100R  [R0402]
R70  ERJ-2RKF1001X  [R0402]
R71  ERJ-2RKF1271X  [R0402]
R72  CRCW040210R0FKED  [R0402]
R73  ERJ-2RKF1001X  [R0402]
R74  ERJ2GE0R00X  [R0402]
R75  ERJ-2RKF1001X  [R0402]
R76  ERJ-2RKF1271X  [R0402]
R77  CRCW040210R0FKED  [R0402]
R78  ERJ-2RKF1001X  [R0402]
R79  ERJ2GE0R00X  [R0402]
R80  AC0402FR-0791RL  [R0402]
R81  AC0402FR-07200RL  [R0402]
R82  AC0402FR-0733RL  [R0402]
R83  CRCW0402100RFKED  [R0402]
R99  CRCW060349R9FKEA  [R0603]
R100  CRCW060349R9FKEA  [R0603]
R101  CRCW0603100RJNEA  [R0603]
R102  CRCW0603100RJNEA  [R0603]
R103  CRCW0603100RJNEA  [R0603]
R104  CRCW0603100RJNEA  [R0603]
R111  CRCW0402100RFKED  [R0402]
R120  CRCW0402100RFKED  [R0402]
R121  CRCW0402100RFKED  [R0402]
R127  ERJ2GE0R00X  [R0402]
R128  ERJ2GE0R00X  [R0402]
R129  AC0402FR-0715RL  [R0402]
R130  AC0402FR-0733RL  [R0402]
R131  AC0402FR-0715RL  [R0402]
R132  AC0402FR-07120RL  [R0402]
R133  AC0402FR-0791RL  [R0402]
R134  AC0402FR-07200RL  [R0402]
R135  RC0402JR-070RL  [R0402]
R136  RC0402JR-070RL  [R0402]
R137  RC0402JR-070RL  [R0402]
R138  RC0402JR-070RL  [R0402]
R139  RC0402JR-070RL  [R0402]
R140  RC0402JR-070RL  [R0402]
R141  RC0402JR-070RL  [R0402]
R142  RC0402JR-070RL  [R0402]
R143  RC0402JR-070RL  [R0402]
R144  RC0402JR-070RL  [R0402]
R145  AC0402FR-07200RL  [R0402]
R146  AC0402FR-0776R8L  [R0402]
R147  AC0402FR-0733RL  [R0402]
R148  RC0402JR-070RL  [R0402]
R149  RC0402JR-070RL  [R0402]
R150  RC0402JR-070RL  [R0402]
R151  RC0402JR-070RL  [R0402]
R152  RC0402JR-070RL  [R0402]
RN3  EXB-2HV470JV  [EXB-2HV470JV]
RN4  EXB-2HV470JV  [EXB-2HV470JV]
RN5  EXB-2HV470JV  [EXB-2HV470JV]
RN6  EXB-2HV470JV  [EXB-2HV470JV]
SW1  KT11P3JM34LFS  [FP-KT11P3JM34LFS-MFG]
SW2  KT11P3JM34LFS  [FP-KT11P3JM34LFS-MFG]
T1  ETC1-1-13TR  [FP-ETC1-1-13TR-MFG]
T4  ETC1-1-13TR  [FP-ETC1-1-13TR-MFG]
T5  ETC1-1-13TR  [FP-ETC1-1-13TR-MFG]
T6  ETC1-1-13TR  [FP-ETC1-1-13TR-MFG]
T7  ETC1-1-13TR  [FP-ETC1-1-13TR-MFG]
T8  ETC1-1-13TR  [FP-ETC1-1-13TR-MFG]
T9  ETC1-1-13TR  [FP-ETC1-1-13TR-MFG]
T10  ETC1-1-13TR  [FP-ETC1-1-13TR-MFG]
TP5  5010  [5010]
TP6  5010  [5010]
TP7  5010  [5010]
TP8  5010  [5010]
U1  DAC3484IRKDT  [TI-RKD88-6300X6300TP_V]  (parts A,B of 2)
U3  ADA4930-2YCPZ-R2  [24-LFCSP]
U5  LTC6957HMS-2#PBF  [12_MSOP]
U6  DAC3484IRKDT  [TI-RKD88-6300X6300TP_V]  (parts A,B of 2)
U7  AD9643BCPZ-250  [64-LFCSP_9X9]
U22  ADT4-1WT  [CD542]
U23  ADT4-1WT  [CD542]
U24  ADT4-1WT  [CD542]
U25  ADT4-1WT  [CD542]
U26  ADT4-1WT  [CD542]
U27  ADT4-1WT  [CD542]
U28  ADT4-1WT  [CD542]
U29  ADT4-1WT  [CD542]
U30  DS90LV001TMX/NOPB  [SOIC_8]

## Sub-sheets
Designator = Clock_Generator: SPI_CLK (in), SPI_MISO (out), SDO, SPI_LE, 3.3VCLK, ADCCLK_P, ADCCLK_N, JX1_DACCLK_DAC1_P, JX1_DACCLK_DAC1_N, JX2_DACCLK_DAC2_P, JX2_DACCLK_DAC2_N, OSTR_DAC1_BUF_P, OSTR_DAC1_BUF_N, OSTR_DAC2_BUF_N, OSTR_DAC2_BUF_P, FPGA_CLK_P, FPGA_CLK_N
Designator = Power_Supply: 1.8V_AVDD, 3.3V_AVDD, 1.8V_DRVDD, 3.3VCLK, 3.3VA_DAC1, 3.3VA_DAC2, 1.2VCLK_DAC1, 1.2VCLK_DAC2, 1.2VDAC1, 1.2VDAC2, 1.2VDIGI_DAC1, 1.2VDIGI_DAC2, 3.3V_LOGIC, 5V_AVDD, VIN_HDR, VCCO_34, VCCO_13

## Ports
JX1_DACCLK_DAC1_N (out), JX1_DACCLK_DAC1_P (out), JX2_DACCLK_DAC2_N (out), JX2_DACCLK_DAC2_P (out)

## Nets
GND: C1.1 C2.1 C3.1 C4.1 C5.1 C6.1 C10.1 C11.1 C19.1 C78.2 C80.2 C81.2 C145.1 C146.1 C147.1 C148.1 C149.1 C150.1 C154.1 C155.1 C156.1 C157.1 C158.1 C159.1 C163.1 C164.1 C165.1 C166.1 C167.1 C168.1 C172.1 C173.1 C174.1 C175.1 C176.1 C177.1 C181.1 C182.1 C183.1 C184.1 C185.1 C186.1 C190.1 C191.1 C192.1 C193.1 C194.1 C195.1 C199.1 C200.1 C201.1 C202.2 C203.2 C204.2 C205.2 C206.2 C207.2 C208.2 C209.2 C210.2 C211.2 C212.2 C213.2 C214.2 C215.2 C216.2 C217.2 C218.2 C219.2 C220.2 C221.2 C222.2 C223.2 C224.2 C225.2 C226.2 C227.2 C228.2 C229.2 C230.2 C231.2 C232.2 C233.2 C234.2 C235.2 C236.2 C237.2 C238.2 C239.2 C240.2 C241.2 C242.2 C243.2 C244.2 C245.2 C246.2 C247.2 C248.2 C249.2 C250.2 C251.2 C252.2 C253.2 C254.2 C255.2 C256.2 C257.2 C258.2 C259.2 C260.2 C261.2 C263.2 C264.2 C277.2 C278.2 C279.2 C280.2 C285.2 C286.2 C287.2 C288.2 J1.15 J1.16 J1.21 J1.22 J1.27 J1.28 J1.33 J1.34 J1.39 J1.40 J1.45 J1.46 J1.51 J1.52 J1.65 J1.66 J1.71 J1.72 J1.77 J1.85 J1.86 J1.95 J1.96 J2.15 J2.16 J2.21 J2.22 J2.27 J2.28 J2.33 J2.34 J2.39 J2.40 J2.45 J2.46 J2.51 J2.52 J2.65 J2.66 J2.71 J2.72 J2.77 J2.85 J2.86 J2.91 J2.92 J4.2 J4.3 J4.4 J4.5 J8.2 J8.3 J8.4 J8.5 J9.2 J9.3 J9.4 J9.5 J10.2 J10.3 J10.4 J10.5 J11.2 J11.3 J11.4 J11.5 J12.2 J12.3 J12.4 J12.5 J13.2 J13.3 J13.4 J13.5 J14.2 J14.3 J14.4 J14.5 J15.2 J15.3 J15.4 J15.5 J16.2 J16.3 J16.4 J16.5 J17.2 J17.3 J17.4 J17.5 J18.2 J18.3 J18.4 J18.5 P1.1 P1.2 P1.19 P1.20 P3.3 P4.3 P5.3 P6.3 P10.1 P10.2 P10.7 P10.8 P11.1 P12.1 P16.3 P17.3 R1.1 R2.1 R3.1 R4.1 R5.1 R6.1 R7.2 R8.1 R10.1 R11.2 R12.1 R13.1 R14.1 R15.1 R16.1 R17.1 R18.1 R19.1 R20.1 R21.1 R22.1 R48.2 R49.2 R59.2 R60.1 R61.2 R62.1 R63.2 R64.1 R65.2 R66.1 R67.2 R68.1 R69.2 R72.2 R77.2 R99.1 R100.1 R132.2 R146.2 SW1.4 SW2.4 T1.4(NC) T4.4(NC) T5.4(NC) T6.4(NC) T7.4(NC) T8.4(NC) T9.4(NC) T10.4(NC) U1.A18(FRAMEN) U1.A29(PARITYN) U1.B16(FRAMEP) U1.B26(PARITYP) U1.C1(GND) U1.C2(GND) U1.C3(GND) U1.C4(GND) U1.C5(GND) U3.15(-VS2) U3.16(-VS2) U3.21(-VS1) U3.22(-VS1) U3.25(EP) U5.1(FILTA) U5.6(FILTB) U5.7(SD2) U5.12(SD1) U6.A18(FRAMEN) U6.A29(PARITYN) U6.B16(FRAMEP) U6.B26(PARITYP) U6.C1(GND) U6.C2(GND) U6.C3(GND) U6.C4(GND) U6.C5(GND) U7.3(SYNC) U7.4(DNC) U7.5(DNC) U7.6(DNC) U7.7(DNC) U7.55(DNC) U7.56(DNC) U7.58(DNC) U7.65(EPAD) U22.3 U22.5 U23.3 U23.5 U24.3 U24.5 U25.3 U25.5 U26.3 U26.5 U27.3 U27.5 U28.3 U28.5 U29.3 U29.5 U30.1(GND)
1.2VCLK_DAC1: C236.1 C237.1 C238.1 U1.A4(CLKVDD) ; sheet Designator/1.2VCLK_DAC1
1.2VCLK_DAC2: C257.1 C258.1 C259.1 U6.A4(CLKVDD) ; sheet Designator/1.2VCLK_DAC2
1.2VDAC1: C232.1 C233.1 C234.1 C235.1 U1.A35(DACVDD) U1.A39(DACVDD) U1.A43(DACVDD) ; sheet Designator/1.2VDAC1
1.2VDAC2: C253.1 C254.1 C255.1 C256.1 U6.A35(DACVDD) U6.A39(DACVDD) U6.A43(DACVDD) ; sheet Designator/1.2VDAC2
1.2VDIGI_DAC1: C227.1 C228.1 C229.1 C230.1 C231.1 U1.A6(DIGVDD) U1.A9(DIGVDD) U1.A25(DIGVDD) U1.A28(DIGVDD) U1.B4(VFUSE) ; sheet Designator/1.2VDIGI_DAC1
1.2VDIGI_DAC2: C248.1 C249.1 C250.1 C251.1 C252.1 U6.A6(DIGVDD) U6.A9(DIGVDD) U6.A25(DIGVDD) U6.A28(DIGVDD) U6.B4(VFUSE) ; sheet Designator/1.2VDIGI_DAC2
1.8V_AVDD: U7.49(AVDD) U7.50(AVDD) U7.53(AVDD) U7.54(AVDD) U7.59(AVDD) U7.60(AVDD) U7.63(AVDD) U7.64(AVDD) ; sheet Designator/1.8V_AVDD
1.8V_DRVDD: P16.1 P17.1 U7.10(DRVDD) U7.19(DRVDD) U7.28(DRVDD) U7.37(DRVDD) ; sheet Designator/1.8V_DRVDD
3.3V_AVDD: P11.3 P12.3 U3.3(+VS1) U3.4(+VS1) U3.9(+VS2) U3.10(+VS2) ; sheet Designator/3.3V_AVDD
3.3V_LOGIC: P3.1 P4.1 P5.1 P6.1 R70.2 R75.2 ; sheet Designator/3.3V_LOGIC
3.3VA_DAC1: C220.1 C221.1 C222.1 C223.1 C224.1 C225.1 C226.1 FB11.1 FB17.1 U1.A36(AVDD) U1.A37(AVDD) U1.A38(AVDD) U1.A40(AVDD) U1.A41(AVDD) U1.A42(AVDD) U1.B31(AVDD) ; sheet Designator/3.3VA_DAC1
3.3VA_DAC2: C241.1 C242.1 C243.1 C244.1 C245.1 C246.1 C247.1 FB18.1 FB19.1 U6.A36(AVDD) U6.A37(AVDD) U6.A38(AVDD) U6.A40(AVDD) U6.A41(AVDD) U6.A42(AVDD) U6.B31(AVDD) ; sheet Designator/3.3VA_DAC2
3.3VCLK: FB22.1 FB23.1 ; sheet Designator/3.3VCLK, sheet Designator/3.3VCLK
5V_AVDD: sheet Designator/5V_AVDD
ADC_D0_N: J2.99 RN6.9
ADC_D0_P: J2.97 RN6.10
ADC_D1_N: J2.95 RN6.11
ADC_D1_P: J2.93 RN6.12
ADC_D2_N: J1.94 RN6.13
ADC_D2_P: J1.92 RN6.14
ADC_D3_N: J1.90 RN6.15
ADC_D3_P: J1.88 RN6.16
ADC_D4_N: J1.93 RN5.9
ADC_D4_P: J1.91 RN5.10
ADC_D5_N: J1.89 RN5.11
ADC_D5_P: J1.87 RN5.12
ADC_D6_N: J1.64 RN5.13
ADC_D6_P: J1.62 RN5.14
ADC_D7_N: J1.56 RN5.15
ADC_D7_P: J1.54 RN5.16
ADC_D8_N: J1.44 RN4.9
ADC_D8_P: J1.42 RN4.10
ADC_D9_N: J1.32 RN4.11
ADC_D9_P: J1.30 RN4.12
ADC_D10_N: J2.69 R148.2 RN4.13
ADC_D10_P: J2.67 R144.2 RN4.14
ADC_D11_N: J2.63 R143.2 RN4.15
ADC_D11_P: J2.61 R142.2 RN4.16
ADC_D12_N: J2.55 R141.2 RN3.9
ADC_D12_P: J2.53 R140.2 RN3.10
ADC_D13_N: J2.49 R139.2 RN3.11
ADC_D13_P: J2.47 R138.2 RN3.12
ADC_DCLK_N: J2.50 RN3.15
ADC_DCLK_P: J2.48 RN3.16
ADC_OR_N: J1.49 RN3.13
ADC_OR_P: J1.47 RN3.14
ADCCLK_N: U7.2(CLK-) ; sheet Designator/ADCCLK_N
ADCCLK_P: U7.1(CLK+) ; sheet Designator/ADCCLK_P
BIASJ_DAC1: R71.1 U1.A33(BIASJ)
BIASJ_DAC2: R76.1 U6.A33(BIASJ)
CS_DAC1: J2.1 U1.B28(SDENB)
CS_DAC2: J2.7 U6.B28(SDENB)
CS_EXTERNAL_COMP: J2.6 R149.1
CSB_ADC: J2.5 U7.46(CSB)
DCLK_N: RN3.2 U7.24(DCO-)
DCLK_P: RN3.1 U7.25(DCO+)
DOUT0_N: RN6.8 U7.8(D0-(LSB))
DOUT0_P: RN6.7 U7.9(D0+(LSB))
DOUT1_N: RN6.6 U7.11(D1-)
DOUT1_P: RN6.5 U7.12(D1+)
DOUT2_N: RN6.4 U7.13(D2-)
DOUT2_P: RN6.3 U7.14(D2+)
DOUT3_N: RN6.2 U7.15(D3-)
DOUT3_P: RN6.1 U7.16(D3+)
DOUT4_N: RN5.8 U7.17(D4-)
DOUT4_P: RN5.7 U7.18(D4+)
DOUT5_N: RN5.6 U7.20(D5-)
DOUT5_P: RN5.5 U7.21(D5+)
DOUT6_N: RN5.4 U7.22(D6-)
DOUT6_P: RN5.3 U7.23(D6+)
DOUT7_N: RN5.2 U7.26(D7-)
DOUT7_P: RN5.1 U7.27(D7+)
DOUT8_N: RN4.8 U7.29(D8-)
DOUT8_P: RN4.7 U7.30(D8+)
DOUT9_N: RN4.6 U7.31(D9-)
DOUT9_P: RN4.5 U7.32(D9+)
DOUT10_N: RN4.4 U7.33(D10-)
DOUT10_P: RN4.3 U7.34(D10+)
DOUT11_N: RN4.2 U7.35(D11-)
DOUT11_P: RN4.1 U7.36(D11+)
DOUT12_N: RN3.8 U7.38(D12-)
DOUT12_P: RN3.7 U7.39(D12+)
DOUT13_N: RN3.6 U7.40(D13-(MSB))
DOUT13_P: RN3.5 U7.41(D13+(MSB))
DXP0_N: J1.100 P10.6
DXP0_P: J1.98 P10.5
EX_SPI_CLK: P1.4 R151.1
EX_SPI_MISO: J2.3 P1.6 U1.A30(SDIO) U6.A30(SDIO) U7.44(SDIO) ; sheet Designator/SPI_MISO  [also labelled SPI_MISO]
EXT_COM_0_N: P1.8 R150.1
EXT_COM_0_P: P1.7 R135.1
EXT_COM_1_N: P1.10 R137.1
EXT_COM_1_P: P1.9 R136.1
EXT_COM_2_N: P1.12 R139.1
EXT_COM_2_P: P1.11 R138.1
EXT_COM_3_N: P1.14 R141.1
EXT_COM_3_P: P1.13 R140.1
EXT_COM_4_N: P1.16 R143.1
EXT_COM_4_P: P1.15 R142.1
EXT_COM_5_N: P1.18 R148.1
EXT_COM_5_P: P1.17 R144.1
EXT_CS_EXTERNAL_COMP: P1.3 R149.2
EXT_SDO: P1.5 R152.2
EXTIO_DAC1: C211.1 U1.A34(EXTIO)
EXTIO_DAC2: C215.1 U6.A34(EXTIO)
FPGA_CLK_N: J1.50 ; sheet Designator/FPGA_CLK_N
FPGA_CLK_P: J1.48 ; sheet Designator/FPGA_CLK_P
GPIO0: J2.94
GPIO1: J2.96
IOUT1A_N: L10.1 R4.2 U1.B38(IOUTAN)
IOUT1A_P: L6.2 R2.2 U1.B39(IOUTAP)
IOUT1B_N: L18.1 R5.2 U1.B37(IOUTBN)
IOUT1B_P: L14.2 R3.2 U1.B36(IOUTBP)
IOUT1C_N: L26.1 R8.2 U1.B34(IOUTCN)
IOUT1C_P: L22.2 R6.2 U1.B35(IOUTCP)
IOUT1D_N: L34.1 R14.2 U1.B33(IOUTDN)
IOUT1D_P: L30.2 R13.2 U1.B32(IOUTDP)
IOUT2A_N: L42.1 R17.2 U6.B38(IOUTAN)
IOUT2A_P: L38.2 R15.2 U6.B39(IOUTAP)
IOUT2B_N: L50.1 R18.2 U6.B37(IOUTBN)
IOUT2B_P: L46.2 R16.2 U6.B36(IOUTBP)
IOUT2C_N: L58.1 R21.2 U6.B34(IOUTCN)
IOUT2C_P: L54.2 R19.2 U6.B35(IOUTCP)
IOUT2D_N: L66.1 R22.2 U6.B33(IOUTDN)
IOUT2D_P: L62.2 R20.2 U6.B32(IOUTDP)
IOVDD_DAC1: C202.1 C203.1 C204.1 C205.1 FB17.2 U1.A17(IOVDD) U1.B6(IOVDD) U1.B25(IOVDD)
IOVDD_DAC2: C206.1 C207.1 C208.1 C209.1 FB19.2 U6.A17(IOVDD) U6.B6(IOVDD) U6.B25(IOVDD)
JX1_D0_DAC1_N: J2.19 U1.A27(D0N_(LSB))
JX1_D0_DAC1_P: J2.17 U1.B24(D0P_(LSB))
JX1_D1_DAC1_N: J2.25 U1.A26(D1N)
JX1_D1_DAC1_P: J2.23 U1.B23(D1P)
JX1_D2_DAC1_N: J2.31 U1.B22(D2N)
JX1_D2_DAC1_P: J2.29 U1.A24(D2P)
JX1_D3_DAC1_N: J2.20 U1.B21(D3N)
JX1_D3_DAC1_P: J2.18 U1.A23(D3P)
JX1_D4_DAC1_N: J2.26 U1.A22(D4N)
JX1_D4_DAC1_P: J2.24 U1.B20(D4P)
JX1_D5_DAC1_N: J2.32 U1.A21(D5N)
JX1_D5_DAC1_P: J2.30 U1.B19(D5P)
JX1_D6_DAC1_N: J2.38 U1.A20(D6N)
JX1_D6_DAC1_P: J2.36 U1.B18(D6P)
JX1_D7_DAC1_N: J2.44 U1.A19(D7N)
JX1_D7_DAC1_P: J2.42 U1.B17(D7P)
JX1_D8_DAC1_N: J2.64 U1.B14(D8N)
JX1_D8_DAC1_P: J2.62 U1.A15(D8P)
JX1_D9_DAC1_N: J2.70 U1.B13(D9N)
JX1_D9_DAC1_P: J2.68 U1.A14(D9P)
JX1_D10_DAC1_N: J2.76 U1.B12(D10N)
JX1_D10_DAC1_P: J2.74 U1.A13(D10P)
JX1_D11_DAC1_N: J2.84 U1.B11(D11N)
JX1_D11_DAC1_P: J2.82 U1.A12(D11P)
JX1_D12_DAC1_N: J2.90 U1.A11(D12N)
JX1_D12_DAC1_P: J2.88 U1.B10(D12P)
JX1_D13_DAC1_N: J2.75 U1.A10(D13N)
JX1_D13_DAC1_P: J2.73 U1.B9(D13P)
JX1_D14_DAC1_N: J2.83 U1.B8(D14N)
JX1_D14_DAC1_P: J2.81 U1.A8(D14P)
JX1_D15_DAC1_N: J2.89 U1.B7(D15N_(MSB))
JX1_D15_DAC1_P: J2.87 U1.A7(D15P_(MSB))
JX1_DACCLK_DAC1_IN_N: C323.1 R121.1 U1.B3(DACCLKN)
JX1_DACCLK_DAC1_IN_P: C322.1 R121.2 U1.A3(DACCLKP)
JX1_DACCLK_DAC1_N: C323.2 ; port JX1_DACCLK_DAC1_N, sheet Designator/JX1_DACCLK_DAC1_N
JX1_DACCLK_DAC1_P: C322.2 ; port JX1_DACCLK_DAC1_P, sheet Designator/JX1_DACCLK_DAC1_P
JX1_DATACLK_DAC1_N: J2.56 U1.B15(DATACLKN)
JX1_DATACLK_DAC1_P: J2.54 U1.A16(DATACLKP)
JX1_LVDS9_N: J1.38 R128.1
JX1_LVDS9_P: J1.36 R127.1
JX2_D0_DAC2_N: J1.84 U6.A27(D0N_(LSB))
JX2_D0_DAC2_P: J1.82 U6.B24(D0P_(LSB))
JX2_D1_DAC2_N: J1.76 U6.A26(D1N)
JX2_D1_DAC2_P: J1.74 U6.B23(D1P)
JX2_D2_DAC2_N: J1.70 U6.B22(D2N)
JX2_D2_DAC2_P: J1.68 U6.A24(D2P)
JX2_D3_DAC2_N: J1.83 U6.B21(D3N)
JX2_D3_DAC2_P: J1.81 U6.A23(D3P)
JX2_D4_DAC2_N: J1.75 U6.A22(D4N)
JX2_D4_DAC2_P: J1.73 U6.B20(D4P)
JX2_D5_DAC2_N: J1.69 U6.A21(D5N)
JX2_D5_DAC2_P: J1.67 U6.B19(D5P)
JX2_D6_DAC2_N: J1.63 U6.A20(D6N)
JX2_D6_DAC2_P: J1.61 U6.B18(D6P)
JX2_D7_DAC2_N: J1.55 U6.A19(D7N)
JX2_D7_DAC2_P: J1.53 U6.B17(D7P)
JX2_D8_DAC2_N: J1.37 U6.B14(D8N)
JX2_D8_DAC2_P: J1.35 U6.A15(D8P)
JX2_D9_DAC2_N: J1.31 U6.B13(D9N)
JX2_D9_DAC2_P: J1.29 U6.A14(D9P)
JX2_D10_DAC2_N: J1.25 U6.B12(D10N)
JX2_D10_DAC2_P: J1.23 U6.A13(D10P)
JX2_D11_DAC2_N: J1.19 U6.B11(D11N)
JX2_D11_DAC2_P: J1.17 U6.A12(D11P)
JX2_D12_DAC2_N: J1.13 U6.A11(D12N)
JX2_D12_DAC2_P: J1.11 U6.B10(D12P)
JX2_D13_DAC2_N: J1.26 U6.A10(D13N)
JX2_D13_DAC2_P: J1.24 U6.B9(D13P)
JX2_D14_DAC2_N: J1.20 U6.B8(D14N)
JX2_D14_DAC2_P: J1.18 U6.A8(D14P)
JX2_D15_DAC2_N: J1.14 U6.B7(D15N_(MSB))
JX2_D15_DAC2_P: J1.12 U6.A7(D15P_(MSB))
JX2_DACCLK_DAC2_IN_N: C319.1 R111.1 U6.B3(DACCLKN)
JX2_DACCLK_DAC2_IN_P: C318.1 R111.2 U6.A3(DACCLKP)
JX2_DACCLK_DAC2_N: C319.2 ; port JX2_DACCLK_DAC2_N, sheet Designator/JX2_DACCLK_DAC2_N
JX2_DACCLK_DAC2_P: C318.2 ; port JX2_DACCLK_DAC2_P, sheet Designator/JX2_DACCLK_DAC2_P
JX2_DATACLK_DAC2_N: J1.43 U6.B15(DATACLKN)
JX2_DATACLK_DAC2_P: J1.41 U6.A16(DATACLKP)
OR_OUT_N: RN3.4 U7.42(OR-)
OR_OUT_P: RN3.3 U7.43(OR+)
OSTR_DAC1_BUF_IN_N: C321.1 R120.1 U1.B2(OSTRN)
OSTR_DAC1_BUF_IN_P: C320.1 R120.2 U1.A2(OSTRP)
OSTR_DAC1_BUF_N: C321.2 ; sheet Designator/OSTR_DAC1_BUF_N
OSTR_DAC1_BUF_P: C320.2 ; sheet Designator/OSTR_DAC1_BUF_P
OSTR_DAC2_BUF_IN_N: C317.1 R83.1 U6.B2(OSTRN)
OSTR_DAC2_BUF_IN_P: C316.1 R83.2 U6.A2(OSTRP)
OSTR_DAC2_BUF_N: C317.2 ; sheet Designator/OSTR_DAC2_BUF_N
OSTR_DAC2_BUF_P: C316.2 ; sheet Designator/OSTR_DAC2_BUF_P
OUT_SYNC_N: J16.1 R104.1 U30.7(OUT-)
OUT_SYNC_P: J15.1 R104.2 U30.6(OUT+)
PLL_AVDD_DAC1: C218.1 C219.1 FB11.2 U1.B1(PLLAVDD)
PLL_AVDD_DAC2: C239.1 C240.1 FB18.2 U6.B1(PLLAVDD)
SDO: J2.2 R152.1 U1.B27(SDO) U6.B27(SDO) ; sheet Designator/SDO
SPI_CLK: J2.4 R151.2 U1.A31(SCLK) U6.A31(SCLK) U7.45(SCLK) ; sheet Designator/SPI_CLK
SPI_LE: J2.8 ; sheet Designator/SPI_LE
SYNC_DAC1_BUF_N: R101.1 U1.B5(SYNCN) U5.10(OUT1-) U30.2(IN-)
SYNC_DAC1_BUF_P: R101.2 U1.A5(SYNCP) U5.11(OUT1+) U30.3(IN+)
SYNC_DAC2_BUF_N: R103.1 U5.9(OUT2-) U6.B5(SYNCN)
SYNC_DAC2_BUF_P: R103.2 U5.8(OUT2+) U6.A5(SYNCP)
SYNC_DAC_C_N: C284.2 U5.4(IN-)
SYNC_DAC_C_P: C283.2 U5.3(IN+)
SYNC_DAC_N: C284.1 R100.2 R102.1 R128.2
SYNC_DAC_P: C283.1 R99.2 R102.2 R127.2
V+U5: C277.1 C278.1 C279.1 C280.1 FB22.2 U5.2(V+)
VCC_DS: C285.1 C286.1 C287.1 C288.1 FB23.2 U30.5(VCC) U30.8(EN)
VCCO_13: J2.98 ; sheet Designator/VCCO_13
VCCO_34: J1.78 J1.79 J1.80 J2.78 J2.79 J2.80 ; sheet Designator/VCCO_34
VIN_A_N: R47.2 U7.52(VIN-A)
VIN_A_P: R45.2 U7.51(VIN+A)
VIN_B_N: R131.2 U7.61(VIN-B)
VIN_B_P: R129.2 U7.62(VIN+B)
VIN_HDR: J1.57 J1.58 J1.59 J1.60 J2.12 J2.57 J2.58 J2.59 J2.60 ; sheet Designator/VIN_HDR
VOCM_1: C260.1 C263.1 R147.2 U3.11(VOCM2) U3.17(VOCM1)
VXP0_N: J1.99 P10.4
VXP0_P: J1.97 P10.3
NetC1_2: C1.2 C7.1 L6.1 L7.2
NetC2_2: C2.2 C8.1 L7.1 L8.2
NetC3_2: C3.2 C9.1 L8.1 L9.2
NetC4_2: C4.2 C7.2 L10.2 L11.1
NetC5_2: C5.2 C8.2 L11.2 L12.1
NetC6_2: C6.2 C9.2 L12.2 L13.1
NetC10_2: C10.2 C142.1 L14.1 L15.2
NetC11_2: C11.2 C143.1 L15.1 L16.2
NetC19_2: C19.2 C144.1 L16.1 L17.2
NetC78_1: C78.1 C79.1 R9.2 R45.1
NetC79_2: C79.2 C80.1 R46.2 R47.1
NetC81_1: C81.1 C83.1 R82.2 R129.1
NetC83_2: C83.2 C261.1 R130.2 R131.1
NetC142_2: C142.2 C145.2 L18.2 L19.1
NetC143_2: C143.2 C146.2 L19.2 L20.1
NetC144_2: C144.2 C147.2 L20.2 L21.1
NetC148_2: C148.2 C151.1 L22.1 L23.2
NetC149_2: C149.2 C152.1 L23.1 L24.2
NetC150_2: C150.2 C153.1 L24.1 L25.2
NetC151_2: C151.2 C154.2 L26.2 L27.1
NetC152_2: C152.2 C155.2 L27.2 L28.1
NetC153_2: C153.2 C156.2 L28.2 L29.1
NetC157_2: C157.2 C160.1 L30.1 L31.2
NetC158_2: C158.2 C161.1 L31.1 L32.2
NetC159_2: C159.2 C162.1 L32.1 L33.2
NetC160_2: C160.2 C163.2 L34.2 L35.1
NetC161_2: C161.2 C164.2 L35.2 L36.1
NetC162_2: C162.2 C165.2 L36.2 L37.1
NetC166_2: C166.2 C169.1 L38.1 L39.2
NetC167_2: C167.2 C170.1 L39.1 L40.2
NetC168_2: C168.2 C171.1 L40.1 L41.2
NetC169_2: C169.2 C172.2 L42.2 L43.1
NetC170_2: C170.2 C173.2 L43.2 L44.1
NetC171_2: C171.2 C174.2 L44.2 L45.1
NetC175_2: C175.2 C178.1 L46.1 L47.2
NetC176_2: C176.2 C179.1 L47.1 L48.2
NetC177_2: C177.2 C180.1 L48.1 L49.2
NetC178_2: C178.2 C181.2 L50.2 L51.1
NetC179_2: C179.2 C182.2 L51.2 L52.1
NetC180_2: C180.2 C183.2 L52.2 L53.1
NetC184_2: C184.2 C187.1 L54.1 L55.2
NetC185_2: C185.2 C188.1 L55.1 L56.2
NetC186_2: C186.2 C189.1 L56.1 L57.2
NetC187_2: C187.2 C190.2 L58.2 L59.1
NetC188_2: C188.2 C191.2 L59.2 L60.1
NetC189_2: C189.2 C192.2 L60.2 L61.1
NetC193_2: C193.2 C196.1 L62.1 L63.2
NetC194_2: C194.2 C197.1 L63.1 L64.2
NetC195_2: C195.2 C198.1 L64.1 L65.2
NetC196_2: C196.2 C199.2 L66.2 L67.1
NetC197_2: C197.2 C200.2 L67.2 L68.1
NetC198_2: C198.2 C201.2 L68.2 L69.1
NetC210_1: C210.1 R70.1 SW1.2 U1.B30(RESETB)
NetC212_1: C212.1 R73.2
NetC213_1: C213.1 R73.1 R74.2
NetC214_1: C214.1 R75.1 SW2.2 U6.B30(RESETB)
NetC216_1: C216.1 R78.2
NetC217_1: C217.1 R78.1 R79.2
NetC264_1: C264.1 R147.1 U7.57(VCM)
NetJ2_35: J2.35 R135.2
NetJ2_37: J2.37 R150.2
NetJ2_41: J2.41 R136.2
NetJ2_43: J2.43 R137.2
NetJ4_1: J4.1 U22.1
NetJ8_1: J8.1 U23.1
NetJ9_1: J9.1 U24.1
NetJ10_1: J10.1 U25.1
NetJ11_1: J11.1 U26.1
NetJ12_1: J12.1 U27.1
NetJ13_1: J13.1 U28.1
NetJ14_1: J14.1 U29.1
NetJ17_1: J17.1 R49.1 R80.1
NetJ18_1: J18.1 R133.1 R146.1
NetL9_1: L9.1 R1.2 T1.2(Primary)
NetL13_2: L13.2 R7.1 T1.1(Primary_Dot)
NetL17_1: L17.1 R10.2 T4.2(Primary)
NetL21_2: L21.2 R11.1 T4.1(Primary_Dot)
NetL25_1: L25.1 R12.2 T5.2(Primary)
NetL29_2: L29.2 R59.1 T5.1(Primary_Dot)
NetL33_1: L33.1 R60.2 T6.2(Primary)
NetL37_2: L37.2 R61.1 T6.1(Primary_Dot)
NetL41_1: L41.1 R62.2 T7.2(Primary)
NetL45_2: L45.2 R63.1 T7.1(Primary_Dot)
NetL49_1: L49.1 R64.2 T8.2(Primary)
NetL53_2: L53.2 R65.1 T8.1(Primary_Dot)
NetL57_1: L57.1 R66.2 T9.2(Primary)
NetL61_2: L61.2 R67.1 T9.1(Primary_Dot)
NetL65_1: L65.1 R68.2 T10.2(Primary)
NetL69_2: L69.2 R69.1 T10.1(Primary_Dot)
NetP3_2: P3.2 U1.A32(TXENABLE)
NetP4_2: P4.2 U1.B40(SLEEP)
NetP5_2: P5.2 U6.A32(TXENABLE)
NetP6_2: P6.2 U6.B40(SLEEP)
NetP11_2: P11.2 U3.20(~{PD1})
NetP12_2: P12.2 U3.14(~{PD2})
NetP16_2: P16.2 U7.48(PDWN)
NetP17_2: P17.2 U7.47(OEB)
NetR9_1: R9.1 U3.18(+OUT1)
NetR46_1: R46.1 U3.19(-OUT1)
NetR48_1: R48.1 R50.1 U3.24(+IN1)
NetR50_2: R50.2 U3.2(+FB1)
NetR71_2: R71.2 R72.1
NetR74_1: R74.1 U1.A1(LPF)
NetR76_2: R76.2 R77.1
NetR79_1: R79.1 U6.A1(LPF)
NetR80_2: R80.2 R81.1 U3.1(-IN1)
NetR81_2: R81.2 U3.23(-FB1)
NetR82_1: R82.1 U3.12(+OUT2)
NetR130_1: R130.1 U3.13(-OUT2)
NetR132_1: R132.1 R134.1 U3.6(+IN2)
NetR133_2: R133.2 R145.1 U3.7(-IN2)
NetR134_2: R134.2 U3.8(+FB2)
NetR145_2: R145.2 U3.5(-FB2)
NetT1_3: T1.3(Secondary) U22.6
NetT1_5: T1.5(Secondary_Dot) U22.4
NetT4_3: T4.3(Secondary) U23.6
NetT4_5: T4.5(Secondary_Dot) U23.4
NetT5_3: T5.3(Secondary) U24.6
NetT5_5: T5.5(Secondary_Dot) U24.4
NetT6_3: T6.3(Secondary) U25.6
NetT6_5: T6.5(Secondary_Dot) U25.4
NetT7_3: T7.3(Secondary) U26.6
NetT7_5: T7.5(Secondary_Dot) U26.4
NetT8_3: T8.3(Secondary) U27.6
NetT8_5: T8.5(Secondary_Dot) U27.4
NetT9_3: T9.3(Secondary) U28.6
NetT9_5: T9.5(Secondary_Dot) U28.4
NetT10_3: T10.3(Secondary) U29.6
NetT10_5: T10.5(Secondary_Dot) U29.4
NetTP5_1: TP5.1 U1.B29(ALARM)
NetTP6_1: TP6.1 U1.A44(TESTMODE)
NetTP7_1: TP7.1 U6.B29(ALARM)
NetTP8_1: TP8.1 U6.A44(TESTMODE)

Not connected (* = marked no-connect by the designer): J1 1 2 3 4 5 6 7 8 9 10; J2 9 10 11 13 14 100; SW1 1 3; SW2 1 3; U5 5(GND); U22 2; U23 2; U24 2; U25 2; U26 2; U27 2; U28 2; U29 2; U30 4(NC)

## Layout directives
differential pair: ADC_D0_N, ADC_D0_P, ADC_D1_N, ADC_D1_P, ADC_D2_N, ADC_D2_P, ADC_D3_N, ADC_D3_P, ADC_D4_N, ADC_D4_P, ADC_D5_N, ADC_D5_P, ADC_D6_N, ADC_D6_P, ADC_D7_N, ADC_D7_P, ADC_D8_N, ADC_D8_P, ADC_D9_N, ADC_D9_P, ADC_D10_N, ADC_D10_P, ADC_D11_N, ADC_D11_P, ADC_D12_N, ADC_D12_P, ADC_D13_N, ADC_D13_P, ADC_DCLK_N, ADC_DCLK_P, ADC_OR_N, ADC_OR_P, ADCCLK_N, ADCCLK_P, DCLK_N, DCLK_P, DOUT0_N, DOUT0_P, DOUT1_N, DOUT1_P, DOUT2_N, DOUT2_P, DOUT3_N, DOUT3_P, DOUT4_N, DOUT4_P, DOUT5_N, DOUT5_P, DOUT6_N, DOUT6_P, DOUT7_N, DOUT7_P, DOUT8_N, DOUT8_P, DOUT9_N, DOUT9_P, DOUT10_N, DOUT10_P, DOUT11_N, DOUT11_P, DOUT12_N, DOUT12_P, DOUT13_N, DOUT13_P, DXP0_N, DXP0_P, EXT_COM_0_N, EXT_COM_0_P, EXT_COM_1_N, EXT_COM_1_P, EXT_COM_2_N, EXT_COM_2_P, EXT_COM_3_N, EXT_COM_3_P, EXT_COM_4_N, EXT_COM_4_P, EXT_COM_5_N, EXT_COM_5_P, FPGA_CLK_N, FPGA_CLK_P, IOUT1A_N, IOUT1A_P, IOUT1B_N, IOUT1B_P, IOUT1C_N, IOUT1C_P, IOUT1D_N, IOUT1D_P, IOUT2A_N, IOUT2A_P, IOUT2B_N, IOUT2B_P, IOUT2C_N, IOUT2C_P, IOUT2D_N, IOUT2D_P, JX1_D0_DAC1_N, JX1_D0_DAC1_P, JX1_D1_DAC1_N, JX1_D1_DAC1_P, JX1_D2_DAC1_N, JX1_D2_DAC1_P, JX1_D3_DAC1_N, JX1_D3_DAC1_P, JX1_D4_DAC1_N, JX1_D4_DAC1_P, JX1_D5_DAC1_N, JX1_D5_DAC1_P, JX1_D6_DAC1_N, JX1_D6_DAC1_P, JX1_D7_DAC1_N, JX1_D7_DAC1_P, JX1_D8_DAC1_N, JX1_D8_DAC1_P, JX1_D9_DAC1_N, JX1_D9_DAC1_P, JX1_D10_DAC1_N, JX1_D10_DAC1_P, JX1_D11_DAC1_N, JX1_D11_DAC1_P, JX1_D12_DAC1_N, JX1_D12_DAC1_P, JX1_D13_DAC1_N, JX1_D13_DAC1_P, JX1_D14_DAC1_N, JX1_D14_DAC1_P, JX1_D15_DAC1_N, JX1_D15_DAC1_P, JX1_DACCLK_DAC1_IN_N, JX1_DACCLK_DAC1_IN_P, JX1_DATACLK_DAC1_N, JX1_DATACLK_DAC1_P, JX1_LVDS9_N, JX1_LVDS9_P, JX2_D0_DAC2_N, JX2_D0_DAC2_P, JX2_D1_DAC2_N, JX2_D1_DAC2_P, JX2_D2_DAC2_N, JX2_D2_DAC2_P, JX2_D3_DAC2_N, JX2_D3_DAC2_P, JX2_D4_DAC2_N, JX2_D4_DAC2_P, JX2_D5_DAC2_N, JX2_D5_DAC2_P, JX2_D6_DAC2_N, JX2_D6_DAC2_P, JX2_D7_DAC2_N, JX2_D7_DAC2_P, JX2_D8_DAC2_N, JX2_D8_DAC2_P, JX2_D9_DAC2_N, JX2_D9_DAC2_P, JX2_D10_DAC2_N, JX2_D10_DAC2_P, JX2_D11_DAC2_N, JX2_D11_DAC2_P, JX2_D12_DAC2_N, JX2_D12_DAC2_P, JX2_D13_DAC2_N, JX2_D13_DAC2_P, JX2_D14_DAC2_N, JX2_D14_DAC2_P, JX2_D15_DAC2_N, JX2_D15_DAC2_P, JX2_DACCLK_DAC2_IN_N, JX2_DACCLK_DAC2_IN_P, JX2_DATACLK_DAC2_N, JX2_DATACLK_DAC2_P, OR_OUT_N, OR_OUT_P, OSTR_DAC1_BUF_IN_N, OSTR_DAC1_BUF_IN_P, OSTR_DAC2_BUF_IN_N, OSTR_DAC2_BUF_IN_P, OUT_SYNC_N, OUT_SYNC_P, SYNC_DAC1_BUF_N, SYNC_DAC1_BUF_P, SYNC_DAC2_BUF_N, SYNC_DAC2_BUF_P, SYNC_DAC_C_N, SYNC_DAC_C_P, SYNC_DAC_N, SYNC_DAC_P, VIN_A_N, VIN_A_P, VIN_B_N, VIN_B_P, VXP0_N, VXP0_P

## Notes on the sheet
- ADC INPUT PATH FOR DUAL INPUTS CIRCUITRY
- 1-2: POWER DOWN
- 2-3:ENABLED
- NEW ADC CIRCUITRY
- Fix4- all around the jumper
- (near U1) Fix8
- AD9643 maximal current usage:
- (near J2) Fix1
- I_(1.8v_AVDD) = 275mA
- I_(1.8v_DRVDD) = 210mA
- NEW: try to put the 0ohm resistors
- 1. Changed SPI lines locations
- 2. Replaced Frame_DAC1
- near P1 port for in an accessable place
- 3. Connected pin 77 to GND
- with DCLK
- 4. Fixed all P-N Mismatch
- instead of VCCO_34
- D. Fitted new AD9643 board pins
- according to board requiremens
- Fix9
- Fix2
- Fixed D12-D13 P-N Mismatch
- Diconnected Frame and Parity
- Fix10
- Fix3
- (near P1) NEW: change of Routing to board- for future communications
- 6. Pin 77  to GND instead of VCCO
- 5. MOVED FPGA_CLK to MRCC pins
- * Removed FRAME & PARITY from J1
- * Fitted new ADC3569 board pins
- Fix5
- Fix7- P/N mismatches
- Fix11
- Fix6
- Labels drawn without touching a wire or pin: SYNC_DAC2_BUF_N